# EAGLE schematic 2x_PJE_Sensoren_DS (EAGLE 9.2.2)

## Sheet 1 of 19
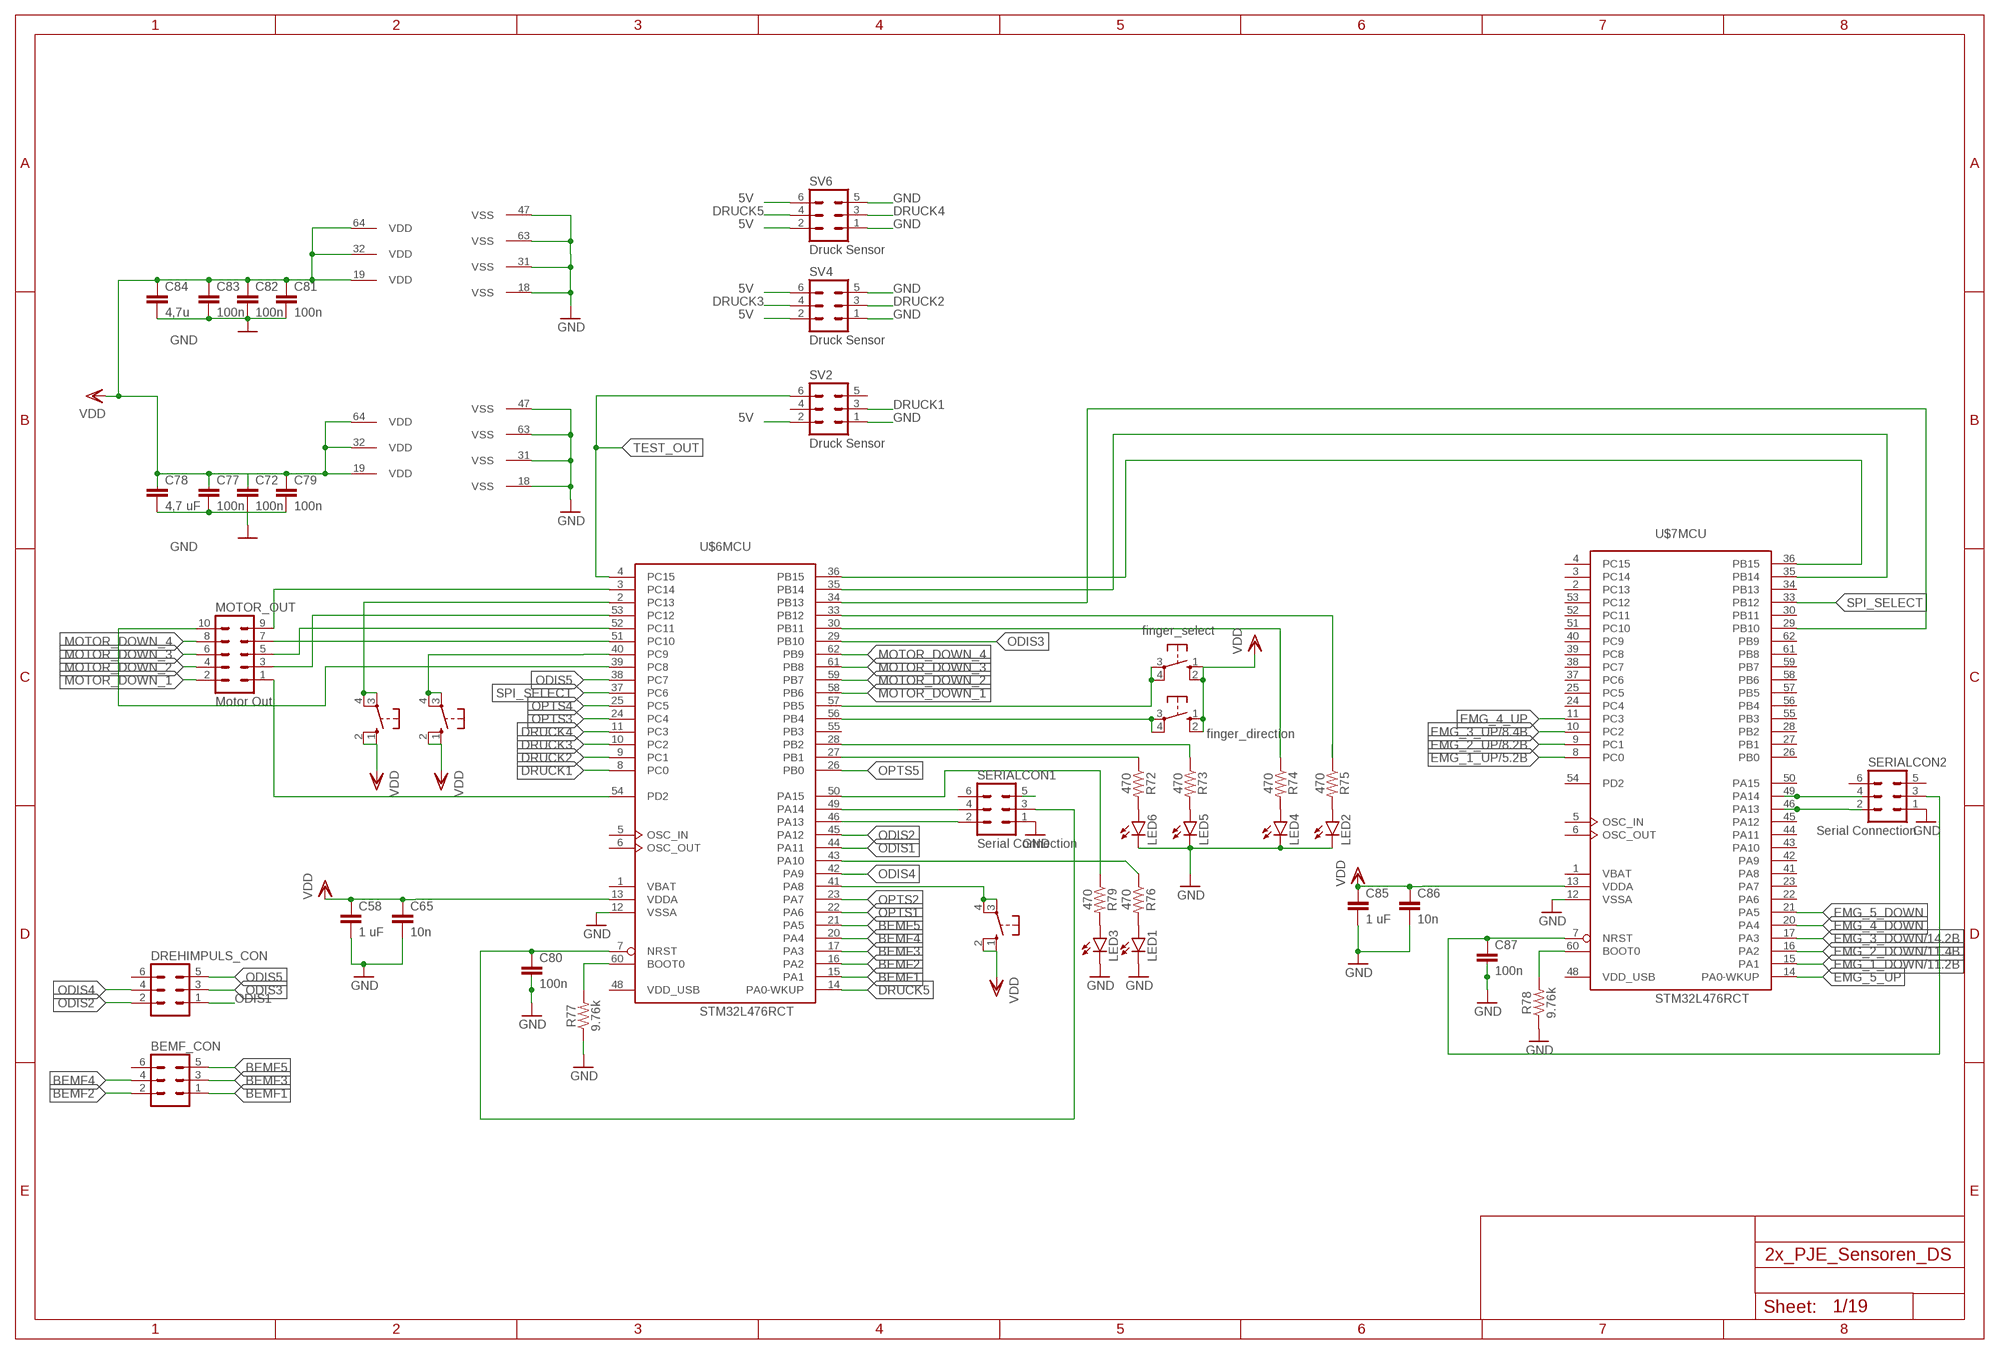
[diagram p0: schematic, sheet 1]

### Parts
BEMF_CON  ML6  [ML6]
BUTTON  10-XX  [B3F-10XX]
C58  1 uF  C-EUC0603  [C0603]
C65  10n  C-EUC0603  [C0603]
C72  100n  C-EUC0603  [C0603]
C77  100n  C-EUC0603  [C0603]
C78  4,7 uF  C-EUC0603  [C0603]
C79  100n  C-EUC0603  [C0603]
C80  100n  C-EUC0603  [C0603]
C81  100n  C-EUC0603  [C0603]
C82  100n  C-EUC0603  [C0603]
C83  100n  C-EUC0603  [C0603]
C84  4,7u  C-EUC0603  [C0603]
C85  1 uF  C-EUC0603  [C0603]
C86  10n  C-EUC0603  [C0603]
C87  100n  C-EUC0603  [C0603]
DREHIMPULS_CON  ML6  [ML6]
FINGER_DIRECTION  finger_direction  10-XX  [B3F-10XX]
FINGER_SELECT  finger_select  10-XX  [B3F-10XX]
LEARN  10-XX  [B3F-10XX]
LEARN_STOP  10-XX  [B3F-10XX]
LED1  LEDCHIP-LED0603  [CHIP-LED0603]
LED2  LEDCHIP-LED0603  [CHIP-LED0603]
LED3  LEDCHIP-LED0603  [CHIP-LED0603]
LED4  LEDCHIP-LED0603  [CHIP-LED0603]
LED5  LEDCHIP-LED0603  [CHIP-LED0603]
LED6  LEDCHIP-LED0603  [CHIP-LED0603]
MOTOR_OUT  Motor Out  ML10  [ML10]
R72  470  4.7KOHM-0603-1/10W-1%  [0603]
R73  470  4.7KOHM-0603-1/10W-1%  [0603]
R74  470  4.7KOHM-0603-1/10W-1%  [0603]
R75  470  4.7KOHM-0603-1/10W-1%  [0603]
R76  470  4.7KOHM-0603-1/10W-1%  [0603]
R77  9.76k  9.76KOHM-0603-1/10W-1%  [0603]
R78  9.76k  9.76KOHM-0603-1/10W-1%  [0603]
R79  470  4.7KOHM-0603-1/10W-1%  [0603]
SERIALCON1  Serial Connection  ML6  [ML6]
SERIALCON2  Serial Connection  ML6  [ML6]
SV2  Druck Sensor  ML6  [ML6]
SV4  Druck Sensor  ML6  [ML6]
SV6  Druck Sensor  ML6  [ML6]
U$6  STM32L476RCT  [LQFP64]
U$7  STM32L476RCT  [LQFP64]

### Nets
5V: SV2.2 SV4.2 SV4.6 SV6.2 SV6.6 ; also sheet 2
BEMF1: BEMF_CON.1 U$6.15(MCU:PA1)
BEMF2: BEMF_CON.2 U$6.16(MCU:PA2)
BEMF3: BEMF_CON.3 U$6.17(MCU:PA3)
BEMF4: BEMF_CON.4 U$6.20(MCU:PA4)
BEMF5: BEMF_CON.5 U$6.21(MCU:PA5)
DRUCK1: SV2.3 U$6.8(MCU:PC0)
DRUCK2: SV4.3 U$6.9(MCU:PC1)
DRUCK3: SV4.4 U$6.10(MCU:PC2)
DRUCK4: SV6.3 U$6.11(MCU:PC3)
DRUCK5: SV6.4 U$6.14(MCU:PA0-WKUP)
EMG_1_DOWN: U$7.15(MCU:PA1) ; also sheet 11
EMG_1_UP: U$7.8(MCU:PC0) ; also sheet 5
EMG_2_DOWN: U$7.16(MCU:PA2) ; also sheet 11
EMG_2_UP: U$7.9(MCU:PC1) ; also sheet 8
EMG_3_DOWN: U$7.17(MCU:PA3) ; also sheet 14
EMG_3_UP: U$7.10(MCU:PC2) ; also sheet 8
EMG_4_DOWN: U$7.20(MCU:PA4)
EMG_4_UP: U$7.11(MCU:PC3)
EMG_5_DOWN: U$7.21(MCU:PA5)
EMG_5_UP: U$7.14(MCU:PA0-WKUP)
GND: C58.2 C65.2 C72.2 C77.2 C78.2 C79.2 C80.2 C81.2 C82.2 C83.2 C84.2 C85.2 C86.2 C87.2 LED1.C LED2.C LED3.C LED4.C LED5.C LED6.C R77.1 R78.1 SERIALCON1.1 SERIALCON2.1 SV2.1 SV4.1 SV4.5 SV6.1 SV6.5 U$6.12(MCU:VSSA) U$6.18(PWR:VSS) U$6.31(PWR:VSS) U$6.47(PWR:VSS) U$6.63(PWR:VSS) U$7.12(MCU:VSSA) U$7.18(PWR:VSS) U$7.31(PWR:VSS) U$7.47(PWR:VSS) U$7.63(PWR:VSS) ; also sheet 2,3,4,5,6,7,8,9,10,11,12,13,14,15,16,17,18,19
LEARN: LEARN.3(P) LEARN.4(P1) U$6.41(MCU:PA8)
LEARN1: BUTTON.3(P) BUTTON.4(P1) U$6.2(MCU:PC13)
LEARN_STOP: LEARN_STOP.3(P) LEARN_STOP.4(P1) U$6.40(MCU:PC9)
LED1: R72.1 U$6.27(MCU:PB1)
LED2: R73.1 U$6.28(MCU:PB2)
LED4: R74.1 U$6.30(MCU:PB11)
LED5: R75.1 U$6.33(MCU:PB12)
MISO: U$6.35(MCU:PB14) U$7.35(MCU:PB14)
MOSI: U$6.36(MCU:PB15) U$7.36(MCU:PB15)
MOTOR_DOWN_1: MOTOR_OUT.2 U$6.58(MCU:PB6)
MOTOR_DOWN_2: MOTOR_OUT.4 U$6.59(MCU:PB7)
MOTOR_DOWN_3: MOTOR_OUT.6 U$6.61(MCU:PB8)
MOTOR_DOWN_4: MOTOR_OUT.8 U$6.62(MCU:PB9)
MOTOR_DOWN_5: MOTOR_OUT.10 U$6.39(MCU:PC8)
MOTOR_UP5: MOTOR_OUT.9 U$6.3(MCU:PC14)
MOTOR_UP_1: MOTOR_OUT.1 U$6.54(MCU:PD2)
MOTOR_UP_2: MOTOR_OUT.3 U$6.53(MCU:PC12)
MOTOR_UP_3: MOTOR_OUT.5 U$6.52(MCU:PC11)
MOTOR_UP_4: MOTOR_OUT.7 U$6.51(MCU:PC10)
N$65: LED6.A R72.2
N$66: LED5.A R73.2
N$67: LED4.A R74.2
N$68: LED2.A R75.2
N$69: LED3.A R79.2
N$70: LED1.A R76.2
N$74: R76.1 U$6.43(MCU:PA10)
N$75: FINGER_DIRECTION.3(P) FINGER_DIRECTION.4(P1) U$6.56(MCU:PB4)
N$76: FINGER_SELECT.3(P) FINGER_SELECT.4(P1) U$6.57(MCU:PB5)
N$90: SERIALCON1.4 U$6.49(MCU:PA14)
N$91: SERIALCON1.2 U$6.46(MCU:PA13)
N$92: R77.2 U$6.60(MCU:BOOT0)
N$93: R78.2 U$7.60(MCU:BOOT0)
N$97: R79.1 U$6.50(MCU:PA15)
N$98: SERIALCON1.5
NRST1: C80.1 SERIALCON1.3 U$6.7(MCU:NRST)
NRST2: C87.1 SERIALCON2.3 U$7.7(MCU:NRST)
ODIS1: DREHIMPULS_CON.1 U$6.44(MCU:PA11)
ODIS2: DREHIMPULS_CON.2 U$6.45(MCU:PA12)
ODIS3: DREHIMPULS_CON.3 U$6.29(MCU:PB10)
ODIS4: DREHIMPULS_CON.4 U$6.42(MCU:PA9)
ODIS5: DREHIMPULS_CON.5 U$6.38(MCU:PC7)
OPTS1: U$6.22(MCU:PA6) ; also sheet 15
OPTS2: U$6.23(MCU:PA7) ; also sheet 16
OPTS3: U$6.24(MCU:PC4) ; also sheet 17
OPTS4: U$6.25(MCU:PC5) ; also sheet 18
OPTS5: U$6.26(MCU:PB0) ; also sheet 19
SPI_CLK: U$6.34(MCU:PB13) U$7.29(MCU:PB10)
SPI_SELECT: U$6.37(MCU:PC6) U$7.33(MCU:PB12)
TCK2: SERIALCON2.4 U$7.49(MCU:PA14)
TEST_OUT: SV2.6 U$6.4(MCU:PC15)
TMS2: SERIALCON2.2 U$7.46(MCU:PA13)
VDD: BUTTON.1(S) BUTTON.2(S1) C58.1 C65.1 C72.1 C77.1 C78.1 C79.1 C81.1 C82.1 C83.1 C84.1 C85.1 C86.1 FINGER_DIRECTION.1(S) FINGER_DIRECTION.2(S1) FINGER_SELECT.1(S) FINGER_SELECT.2(S1) LEARN.1(S) LEARN.2(S1) LEARN_STOP.1(S) LEARN_STOP.2(S1) U$6.13(MCU:VDDA) U$6.19(PWR:VDD) U$6.32(PWR:VDD) U$6.64(PWR:VDD) U$7.13(MCU:VDDA) U$7.19(PWR:VDD) U$7.32(PWR:VDD) U$7.64(PWR:VDD) ; also sheet 2,3,4,5,6,7,8,9,10,11,12,13,14,15,16,17,18,19
Unconnected: BEMF_CON.6 DREHIMPULS_CON.6 SERIALCON1.6 SERIALCON2.5 SERIALCON2.6 SV2.4 SV2.5 U$6.5(MCU:OSC_IN) U$6.6(MCU:OSC_OUT) U$6.55(MCU:PB3) U$7.2(MCU:PC13) U$7.3(MCU:PC14) U$7.4(MCU:PC15) U$7.5(MCU:OSC_IN) U$7.6(MCU:OSC_OUT) U$7.22(MCU:PA6) U$7.23(MCU:PA7) U$7.24(MCU:PC4) U$7.25(MCU:PC5) U$7.26(MCU:PB0) U$7.27(MCU:PB1) U$7.28(MCU:PB2) U$7.30(MCU:PB11) U$7.34(MCU:PB13) U$7.37(MCU:PC6) U$7.38(MCU:PC7) U$7.39(MCU:PC8) U$7.40(MCU:PC9) U$7.41(MCU:PA8) U$7.42(MCU:PA9) U$7.43(MCU:PA10) U$7.44(MCU:PA11) U$7.45(MCU:PA12) U$7.50(MCU:PA15) U$7.51(MCU:PC10) U$7.52(MCU:PC11) U$7.53(MCU:PC12) U$7.54(MCU:PD2) U$7.55(MCU:PB3) U$7.56(MCU:PB4) U$7.57(MCU:PB5) U$7.58(MCU:PB6) U$7.59(MCU:PB7) U$7.61(MCU:PB8) U$7.62(MCU:PB9)

## Sheet 2 of 19
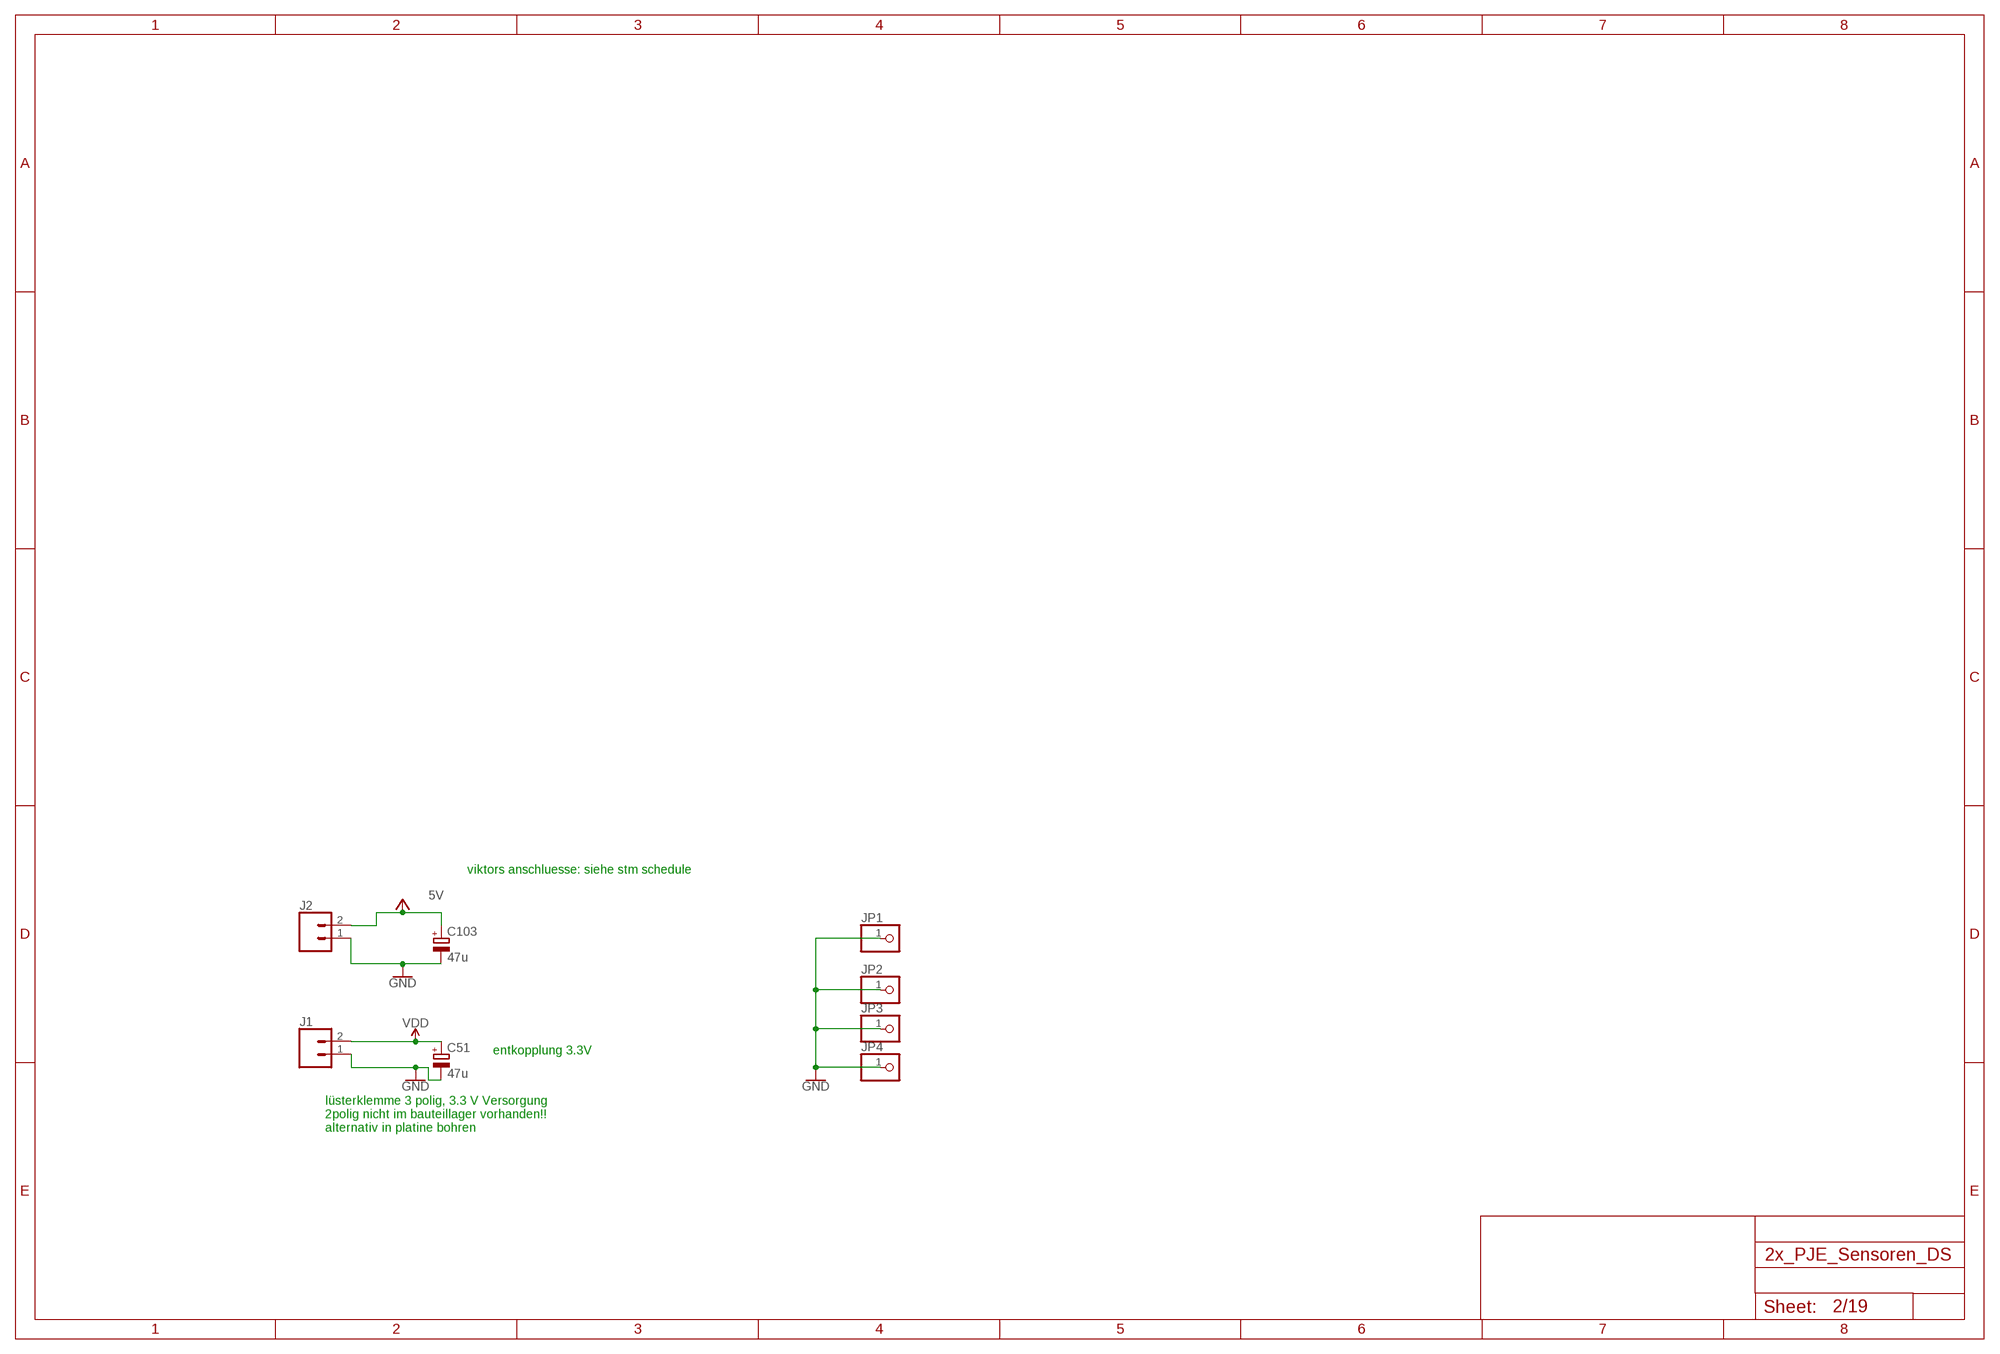
[diagram p1: schematic, sheet 2]

### Parts
C51  47u  CPOL-EUTAP5-70  [TAP5-70]
C103  47u  CPOL-EUTAP5-70  [TAP5-70]
J1  CONN_02POLAR  [MOLEX-1X2]
J2  CONN_02POLAR  [MOLEX-1X2]
JP1  PINHD-1X1  [1X01]
JP2  PINHD-1X1  [1X01]
JP3  PINHD-1X1  [1X01]
JP4  PINHD-1X1  [1X01]

### Nets
5V: C103.+ J2.2 ; supply symbol labelled +5V ; also sheet 1
GND: C51.- C103.- J1.1 J2.1 JP1.1 JP2.1 JP3.1 JP4.1 ; also sheet 1,3,4,5,6,7,8,9,10,11,12,13,14,15,16,17,18,19
VDD: C51.+ J1.2 ; also sheet 1,3,4,5,6,7,8,9,10,11,12,13,14,15,16,17,18,19

### Notes on the sheet
- viktors anschluesse: siehe stm schedule
- entkopplung 3.3V
- lüsterklemme 3 polig, 3.3 V Versorgung
  2polig nicht im bauteillager vorhanden!!
  alternativ in platine bohren

## Sheet 3 of 19
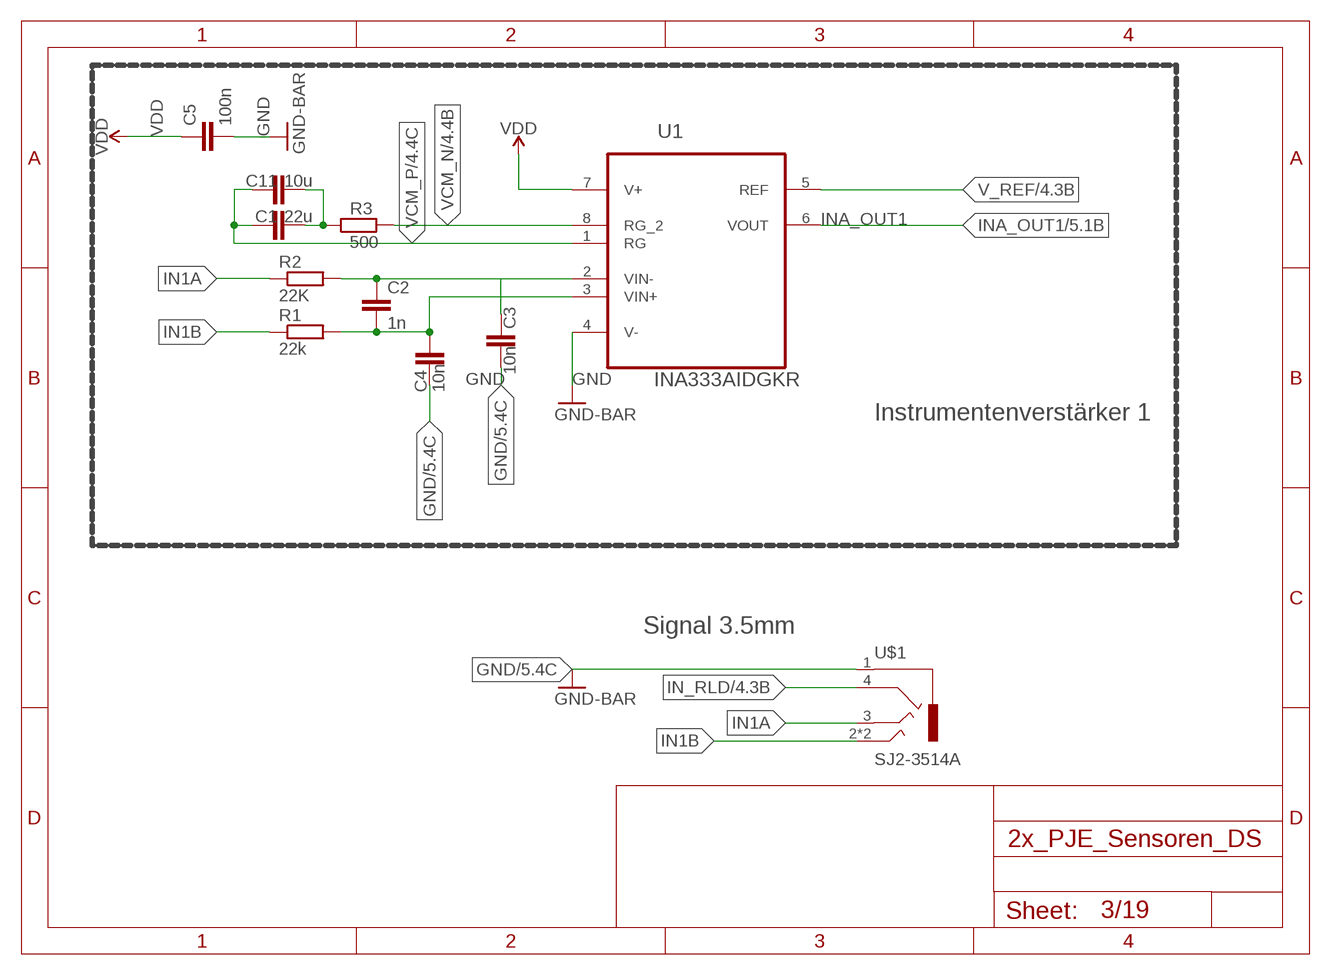
[diagram p2: schematic, sheet 3]

### Parts
C1  22u  C-EUC0603  [C0603]
C2  1n  C-EUC0603  [C0603]
C3  10n  C-EUC0603  [C0603]
C4  10n  C-EUC0603  [C0603]
C5  100n  C-EUC0603  [C0603]
C11  10u  C-EUC0603  [C0603]
R1  22k  R-EU_R0603  [R0603]
R2  22K  R-EU_R0603  [R0603]
R3  500  R-EU_R0603  [R0603]
U1  INA333AIDGKR  [SOP65P490X110-8N]
U$1  SJ2-3514A  [USR_SJ2-4514A]

### Nets
GND: C3.2 C4.2 C5.2 U1.4(V-) U$1.1 ; supply symbol labelled GND-BAR ; also sheet 1,2,4,5,6,7,8,9,10,11,12,13,14,15,16,17,18,19
IN1A: R2.1 U$1.3
IN1B: R1.1 U$1.2 U$1.2_2
IN_RLD: U$1.4 ; also sheet 4
INA_OUT1: U1.6(VOUT) ; also sheet 5
N$3: C2.2 C4.1 R1.2 U1.3(VIN+)
N$4: C1.2 C11.2 R3.1
N$35: C2.1 C3.1 R2.2 U1.2(VIN-)
V_REF: U1.5(REF) ; also sheet 4,5,6,7,8,9,10,11,12,13,14
VCM_N: R3.2 U1.8(RG_2) ; also sheet 4
VCM_P: C1.1 C11.1 U1.1(RG) ; also sheet 4
VDD: C5.1 U1.7(V+) ; also sheet 1,2,4,5,6,7,8,9,10,11,12,13,14,15,16,17,18,19

### Notes on the sheet
- Instrumentenverstärker 1
- Signal 3.5mm

## Sheet 4 of 19
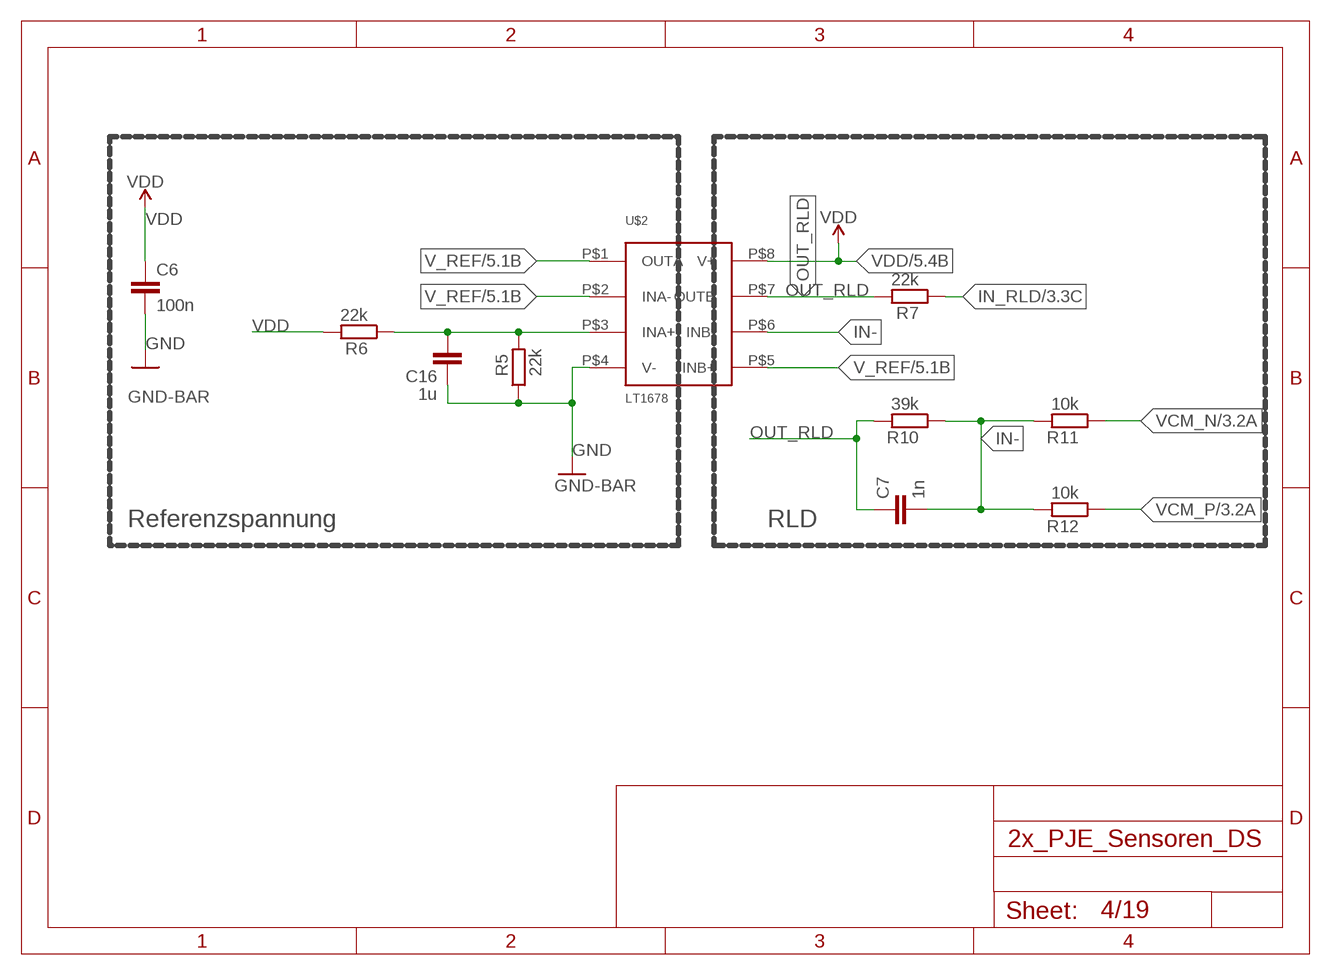
[diagram p3: schematic, sheet 4]

### Parts
C6  100n  C-EUC0603  [C0603]
C7  1n  C-EUC0603  [C0603]
C16  1u  C-EUC0603  [C0603]
R5  22k  R-EU_R0603  [R0603]
R6  22k  R-EU_R0603  [R0603]
R7  22k  R-EU_R0603  [R0603]
R10  39k  R-EU_R0603  [R0603]
R11  10k  R-EU_R0603  [R0603]
R12  10k  R-EU_R0603  [R0603]
U$2  LT1678  [S8]

### Nets
GND: C6.2 C16.1 R5.1 U$2.P$4(V-) ; supply symbol labelled GND-BAR ; also sheet 1,2,3,5,6,7,8,9,10,11,12,13,14,15,16,17,18,19
IN-: C7.2 R10.1 R11.2 R12.2 U$2.P$6(INB-)
IN_RLD: R7.1 ; also sheet 3
N$11: C16.2 R5.2 R6.1 U$2.P$3(INA+)
OUT_RLD: C7.1 R7.2 R10.2 U$2.P$7(OUTB)
V_REF: U$2.P$1(OUTA) U$2.P$2(INA-) U$2.P$5(INB+) ; also sheet 3,5,6,7,8,9,10,11,12,13,14
VCM_N: R11.1 ; also sheet 3
VCM_P: R12.1 ; also sheet 3
VDD: C6.1 R6.2 U$2.P$8(V+) ; also sheet 1,2,3,5,6,7,8,9,10,11,12,13,14,15,16,17,18,19

### Notes on the sheet
- Referenzspannung | RLD

## Sheet 5 of 19
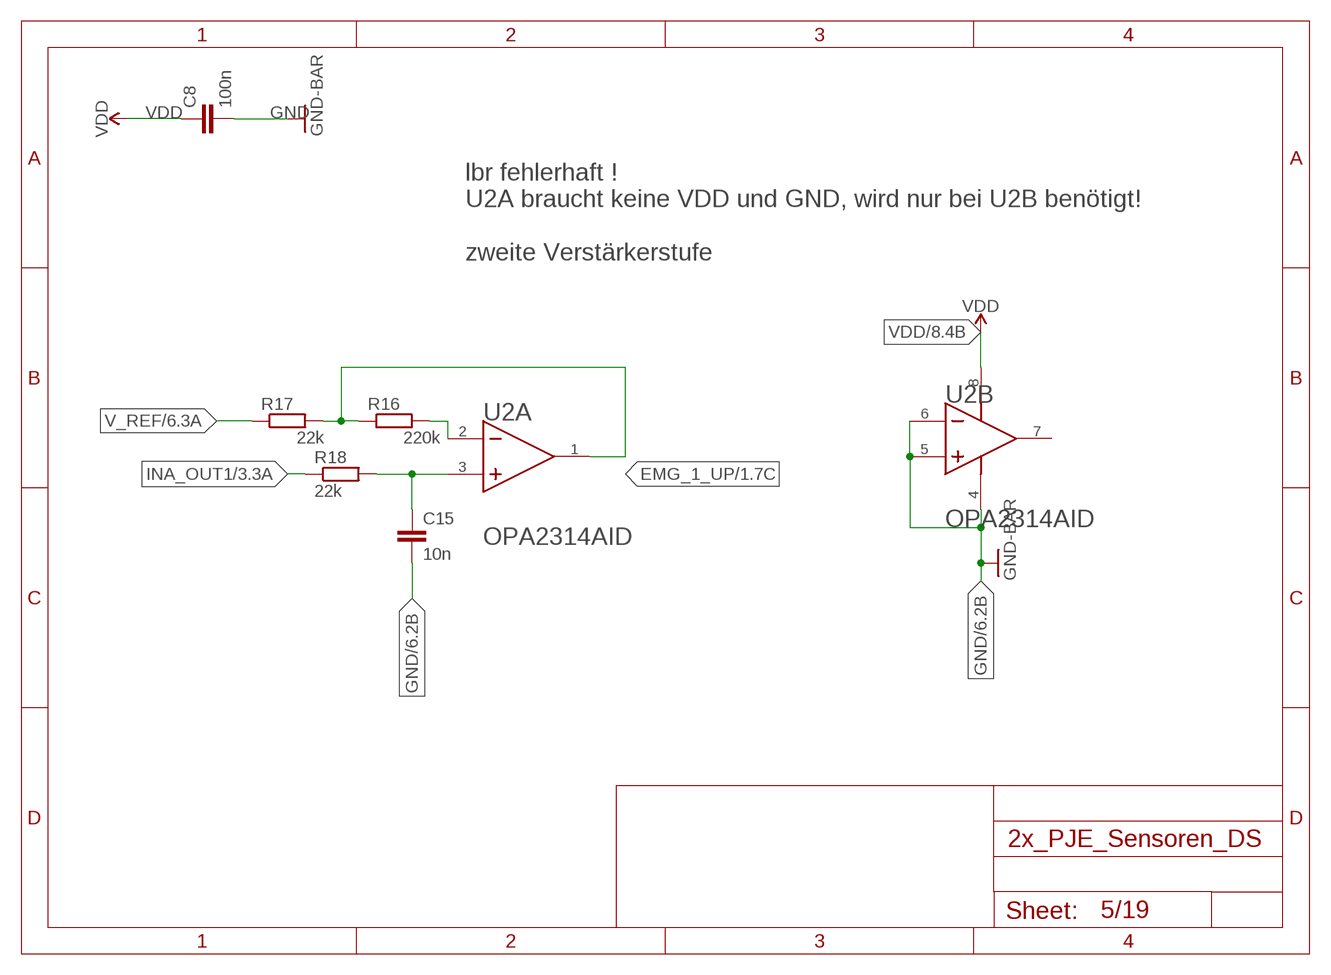
[diagram p4: schematic, sheet 5]

### Parts
C8  100n  C-EUC0603  [C0603]
C15  10n  C-EUC0603  [C0603]
R16  220k  R-EU_R0603  [R0603]
R17  22k  R-EU_R0603  [R0603]
R18  22k  R-EU_R0603  [R0603]
U2  TEXAS_INSTRUMENTS_OPA2314AIDTEXAS_INSTRUMENTS_OPA2314AID_0_0  [TEXAS_INSTRUMENTS_OPA2314AID_0]

### Nets
EMG_1_UP: R16.1 R17.2 U2.1(A:OUT_A) ; also sheet 1
GND: C8.2 C15.2 U2.4(B:V-) U2.5(B:IN_B+) U2.6(B:IN_B-) ; supply symbol labelled GND-BAR ; also sheet 1,2,3,4,6,7,8,9,10,11,12,13,14,15,16,17,18,19
INA_OUT1: R18.1 ; also sheet 3
N$16: R16.2 U2.2(A:IN_A-)
N$17: C15.1 R18.2 U2.3(A:IN_A+)
V_REF: R17.1 ; also sheet 3,4,6,7,8,9,10,11,12,13,14
VDD: C8.1 U2.8(B:V+) ; also sheet 1,2,3,4,6,7,8,9,10,11,12,13,14,15,16,17,18,19
Unconnected: U2.7(B:OUT_B)

### Notes on the sheet
- lbr fehlerhaft !
  U2A braucht keine VDD und GND, wird nur bei U2B benötigt!
  
  zweite Verstärkerstufe

## Sheet 6 of 19
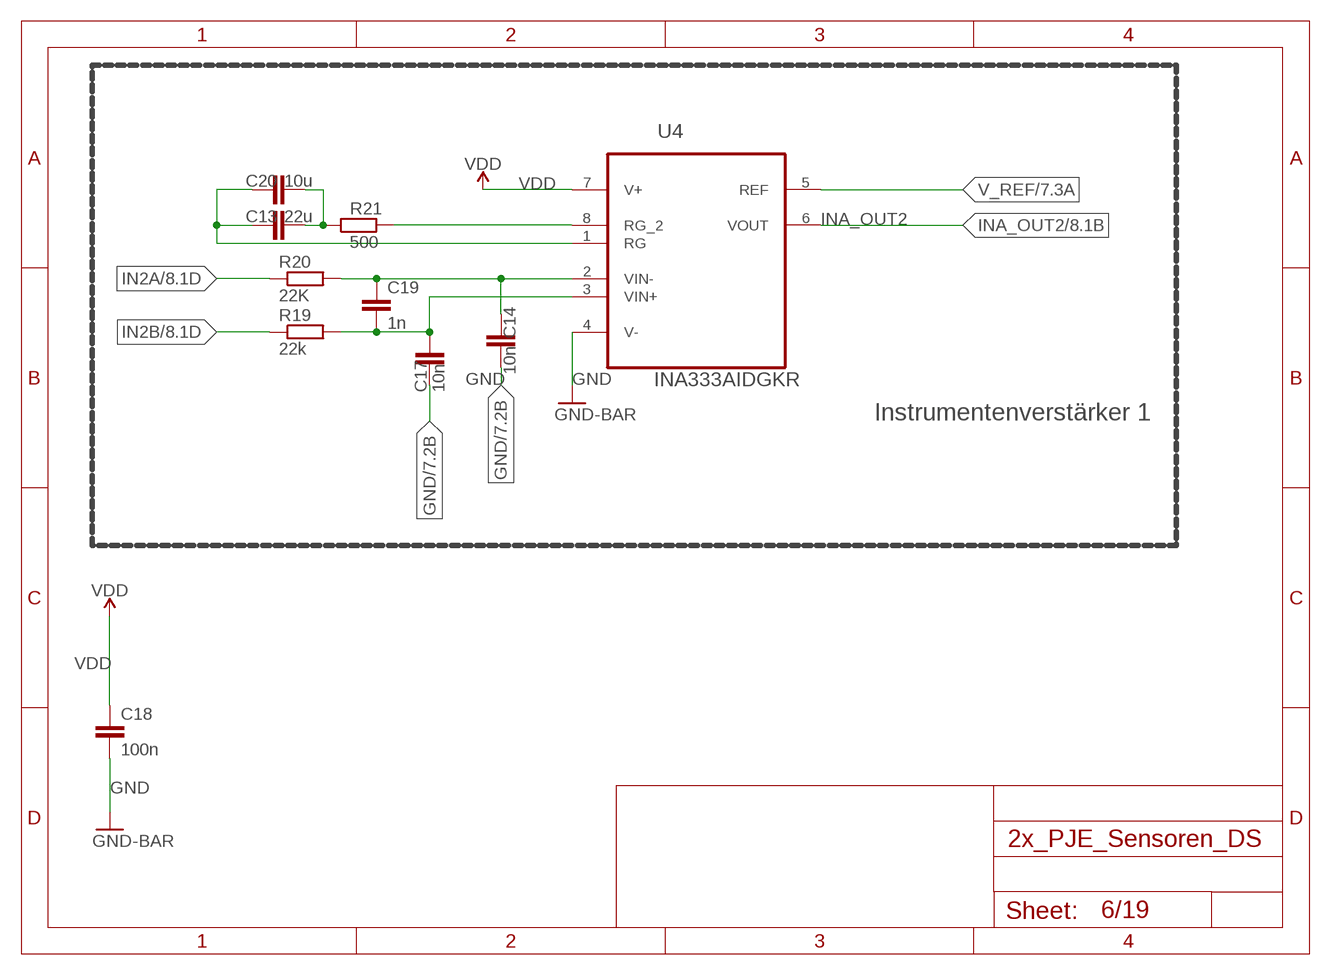
[diagram p5: schematic, sheet 6]

### Parts
C13  22u  C-EUC0603  [C0603]
C14  10n  C-EUC0603  [C0603]
C17  10n  C-EUC0603  [C0603]
C18  100n  C-EUC0603  [C0603]
C19  1n  C-EUC0603  [C0603]
C20  10u  C-EUC0603  [C0603]
R19  22k  R-EU_R0603  [R0603]
R20  22K  R-EU_R0603  [R0603]
R21  500  R-EU_R0603  [R0603]
U4  INA333AIDGKR  [SOP65P490X110-8N]

### Nets
GND: C14.2 C17.2 C18.2 U4.4(V-) ; supply symbol labelled GND-BAR ; also sheet 1,2,3,4,5,7,8,9,10,11,12,13,14,15,16,17,18,19
IN2A: R20.1 ; also sheet 8
IN2B: R19.1 ; also sheet 8
INA_OUT2: U4.6(VOUT) ; also sheet 8
N$1: C13.2 C20.2 R21.1
N$5: R21.2 U4.8(RG_2)
N$6: C13.1 C20.1 U4.1(RG)
N$7: C14.1 C19.1 R20.2 U4.2(VIN-)
N$12: C17.1 C19.2 R19.2 U4.3(VIN+)
V_REF: U4.5(REF) ; also sheet 3,4,5,7,8,9,10,11,12,13,14
VDD: C18.1 U4.7(V+) ; also sheet 1,2,3,4,5,7,8,9,10,11,12,13,14,15,16,17,18,19

### Notes on the sheet
- Instrumentenverstärker 1

## Sheet 7 of 19
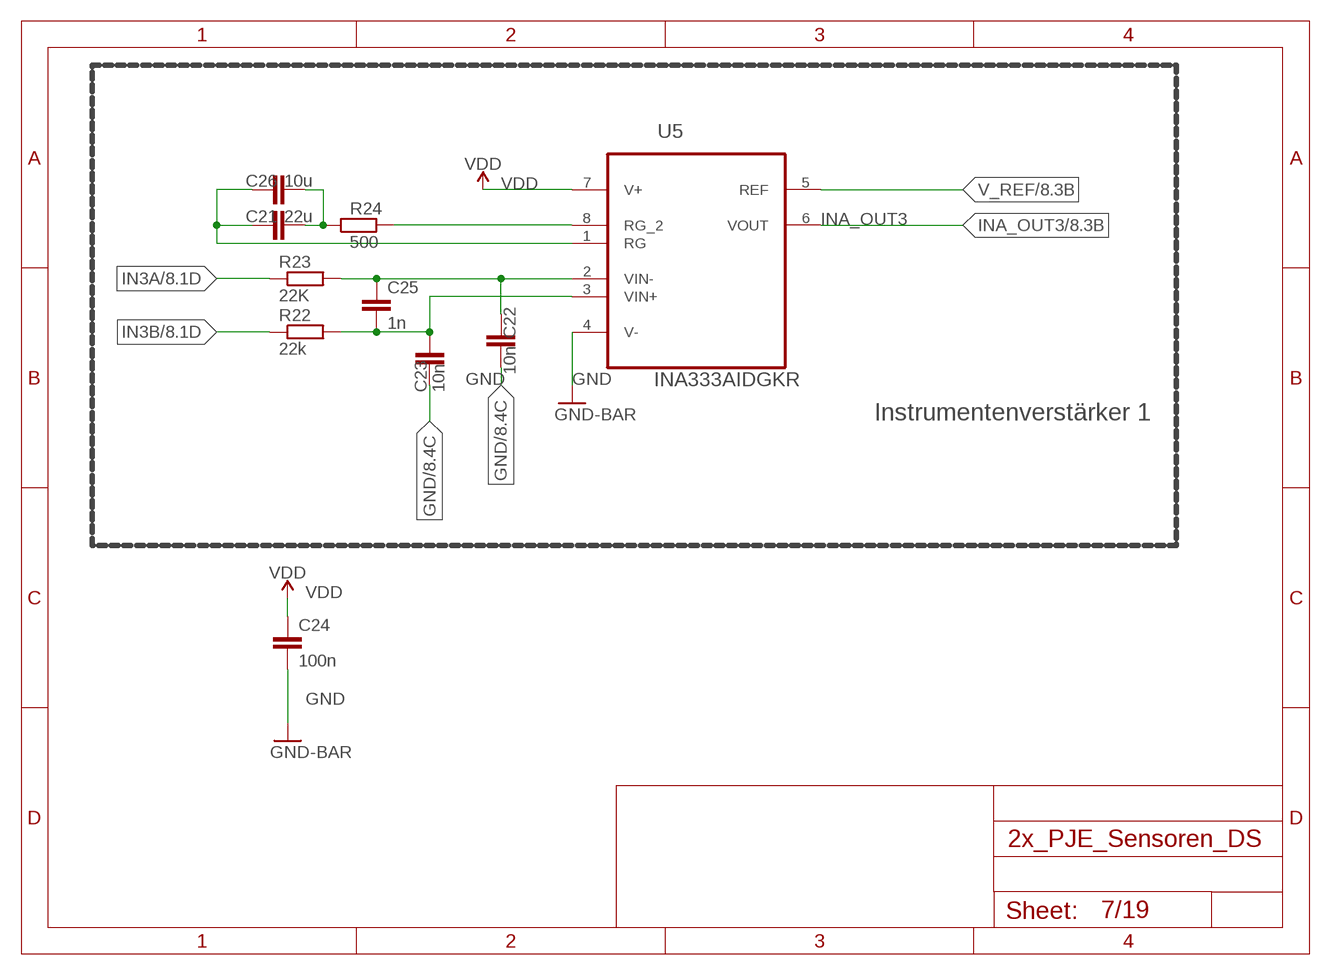
[diagram p6: schematic, sheet 7]

### Parts
C21  22u  C-EUC0603  [C0603]
C22  10n  C-EUC0603  [C0603]
C23  10n  C-EUC0603  [C0603]
C24  100n  C-EUC0603  [C0603]
C25  1n  C-EUC0603  [C0603]
C26  10u  C-EUC0603  [C0603]
R22  22k  R-EU_R0603  [R0603]
R23  22K  R-EU_R0603  [R0603]
R24  500  R-EU_R0603  [R0603]
U5  INA333AIDGKR  [SOP65P490X110-8N]

### Nets
GND: C22.2 C23.2 C24.2 U5.4(V-) ; supply symbol labelled GND-BAR ; also sheet 1,2,3,4,5,6,8,9,10,11,12,13,14,15,16,17,18,19
IN3A: R23.1 ; also sheet 8
IN3B: R22.1 ; also sheet 8
INA_OUT3: U5.6(VOUT) ; also sheet 8
N$8: C21.2 C26.2 R24.1
N$9: R24.2 U5.8(RG_2)
N$10: C21.1 C26.1 U5.1(RG)
N$13: C22.1 C25.1 R23.2 U5.2(VIN-)
N$14: C23.1 C25.2 R22.2 U5.3(VIN+)
V_REF: U5.5(REF) ; also sheet 3,4,5,6,8,9,10,11,12,13,14
VDD: C24.1 U5.7(V+) ; also sheet 1,2,3,4,5,6,8,9,10,11,12,13,14,15,16,17,18,19

### Notes on the sheet
- Instrumentenverstärker 1

## Sheet 8 of 19
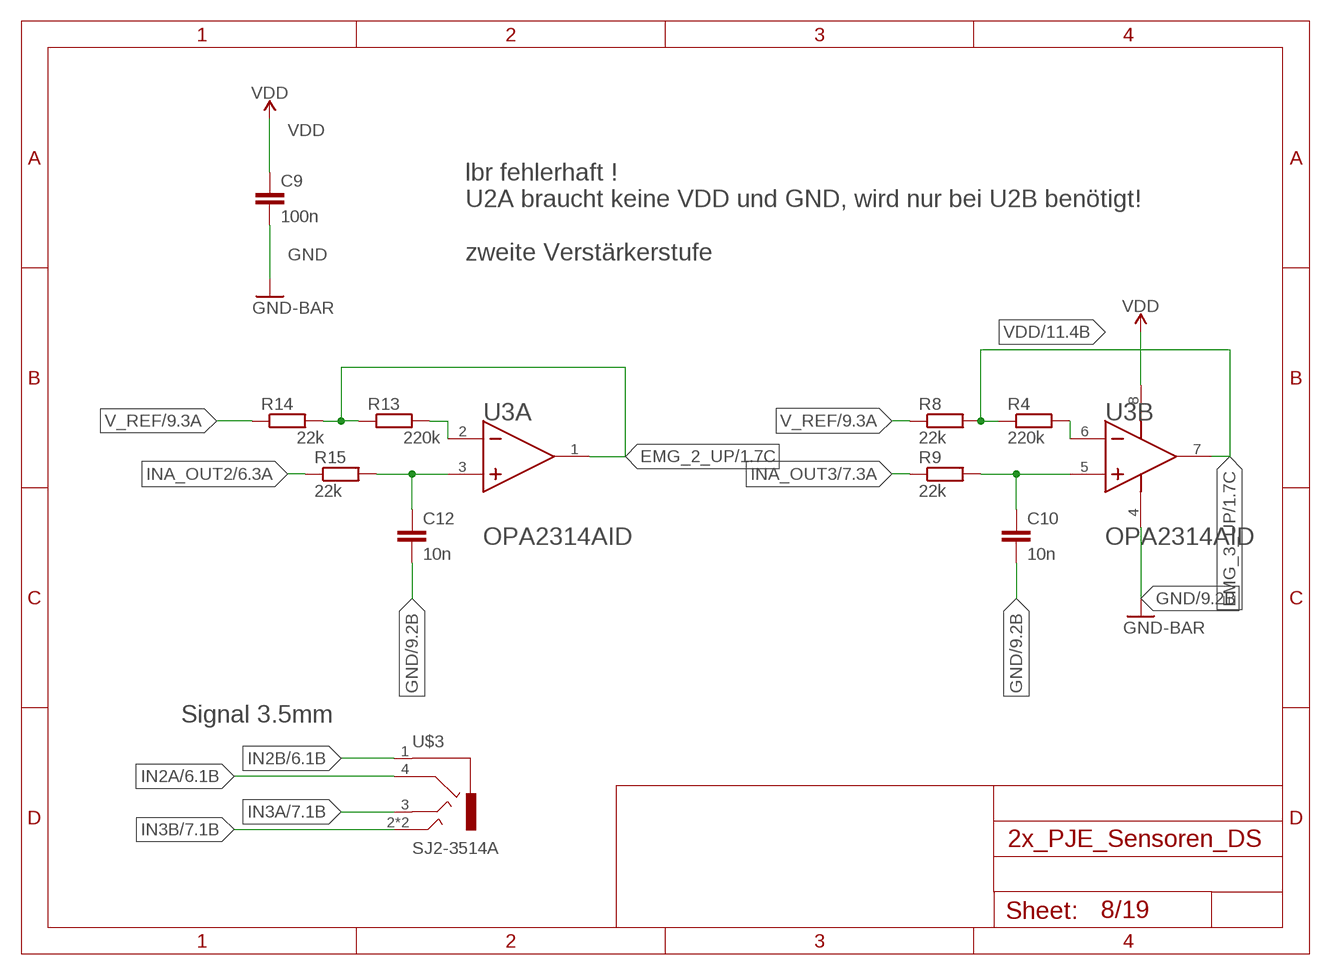
[diagram p7: schematic, sheet 8]

### Parts
C9  100n  C-EUC0603  [C0603]
C10  10n  C-EUC0603  [C0603]
C12  10n  C-EUC0603  [C0603]
R4  220k  R-EU_R0603  [R0603]
R8  22k  R-EU_R0603  [R0603]
R9  22k  R-EU_R0603  [R0603]
R13  220k  R-EU_R0603  [R0603]
R14  22k  R-EU_R0603  [R0603]
R15  22k  R-EU_R0603  [R0603]
U3  TEXAS_INSTRUMENTS_OPA2314AIDTEXAS_INSTRUMENTS_OPA2314AID_0_0  [TEXAS_INSTRUMENTS_OPA2314AID_0]
U$3  SJ2-3514A  [USR_SJ2-4514A]

### Nets
EMG_2_UP: R13.1 R14.2 U3.1(A:OUT_A) ; also sheet 1
EMG_3_UP: R4.1 R8.2 U3.7(B:OUT_B) ; also sheet 1
GND: C9.2 C10.2 C12.2 U3.4(B:V-) ; supply symbol labelled GND-BAR ; also sheet 1,2,3,4,5,6,7,9,10,11,12,13,14,15,16,17,18,19
IN2A: U$3.4 ; also sheet 6
IN2B: U$3.1 ; also sheet 6
IN3A: U$3.3 ; also sheet 7
IN3B: U$3.2 U$3.2_2 ; also sheet 7
INA_OUT2: R15.1 ; also sheet 6
INA_OUT3: R9.1 ; also sheet 7
N$15: C10.1 R9.2 U3.5(B:IN_B+)
N$18: R4.2 U3.6(B:IN_B-)
N$19: C12.1 R15.2 U3.3(A:IN_A+)
N$20: R13.2 U3.2(A:IN_A-)
V_REF: R8.1 R14.1 ; also sheet 3,4,5,6,7,9,10,11,12,13,14
VDD: C9.1 U3.8(B:V+) ; also sheet 1,2,3,4,5,6,7,9,10,11,12,13,14,15,16,17,18,19

### Notes on the sheet
- lbr fehlerhaft !
  U2A braucht keine VDD und GND, wird nur bei U2B benötigt!
  
  zweite Verstärkerstufe
- Signal 3.5mm

## Sheet 9 of 19
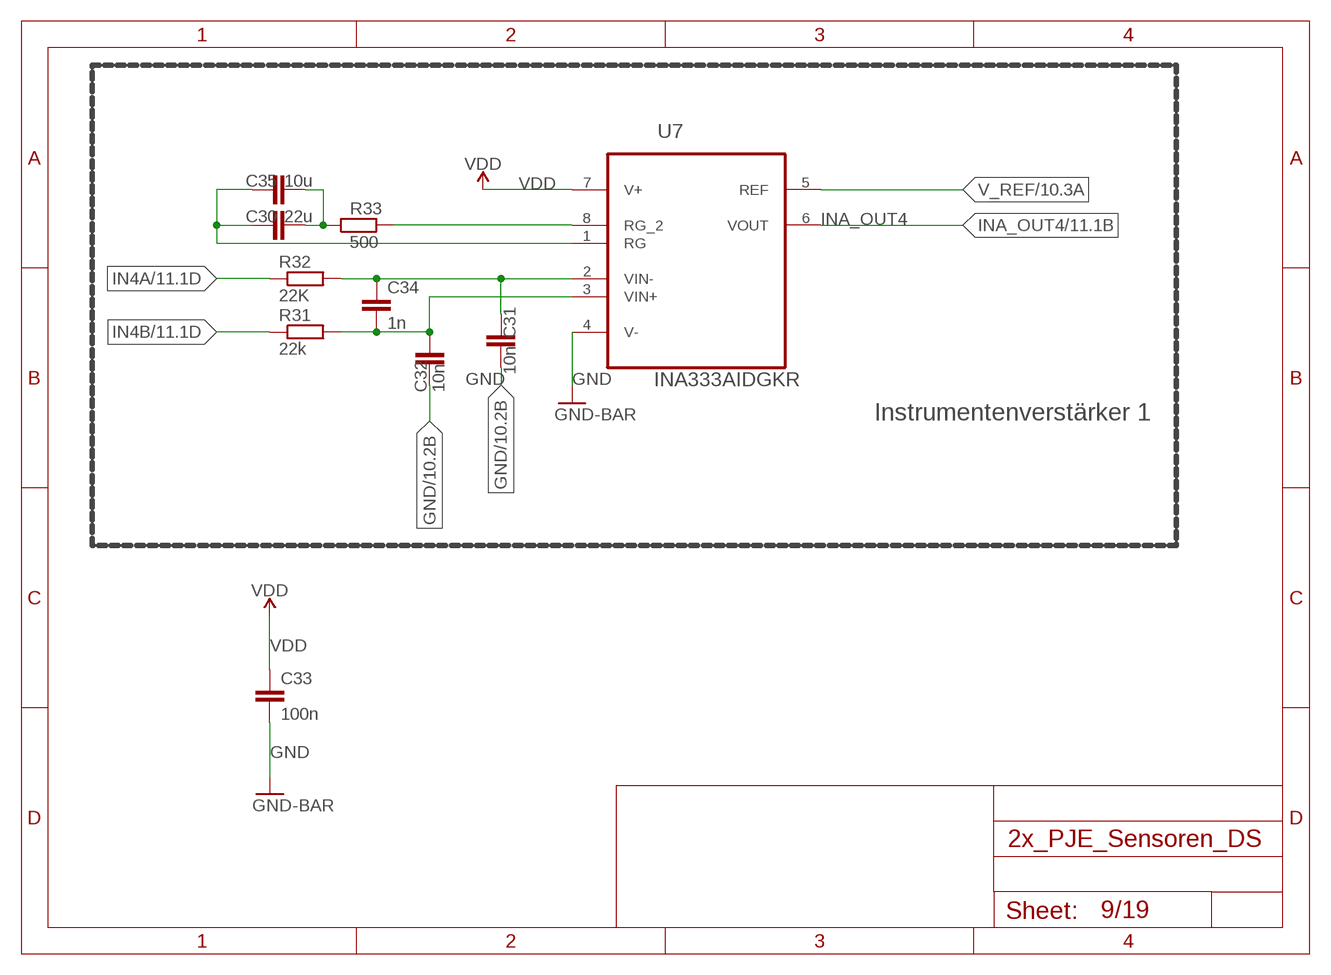
[diagram p8: schematic, sheet 9]

### Parts
C30  22u  C-EUC0603  [C0603]
C31  10n  C-EUC0603  [C0603]
C32  10n  C-EUC0603  [C0603]
C33  100n  C-EUC0603  [C0603]
C34  1n  C-EUC0603  [C0603]
C35  10u  C-EUC0603  [C0603]
R31  22k  R-EU_R0603  [R0603]
R32  22K  R-EU_R0603  [R0603]
R33  500  R-EU_R0603  [R0603]
U7  INA333AIDGKR  [SOP65P490X110-8N]

### Nets
GND: C31.2 C32.2 C33.2 U7.4(V-) ; supply symbol labelled GND-BAR ; also sheet 1,2,3,4,5,6,7,8,10,11,12,13,14,15,16,17,18,19
IN4A: R32.1 ; also sheet 11
IN4B: R31.1 ; also sheet 11
INA_OUT4: U7.6(VOUT) ; also sheet 11
N$21: C30.2 C35.2 R33.1
N$22: R33.2 U7.8(RG_2)
N$23: C30.1 C35.1 U7.1(RG)
N$24: C31.1 C34.1 R32.2 U7.2(VIN-)
N$25: C32.1 C34.2 R31.2 U7.3(VIN+)
V_REF: U7.5(REF) ; also sheet 3,4,5,6,7,8,10,11,12,13,14
VDD: C33.1 U7.7(V+) ; also sheet 1,2,3,4,5,6,7,8,10,11,12,13,14,15,16,17,18,19

### Notes on the sheet
- Instrumentenverstärker 1

## Sheet 10 of 19
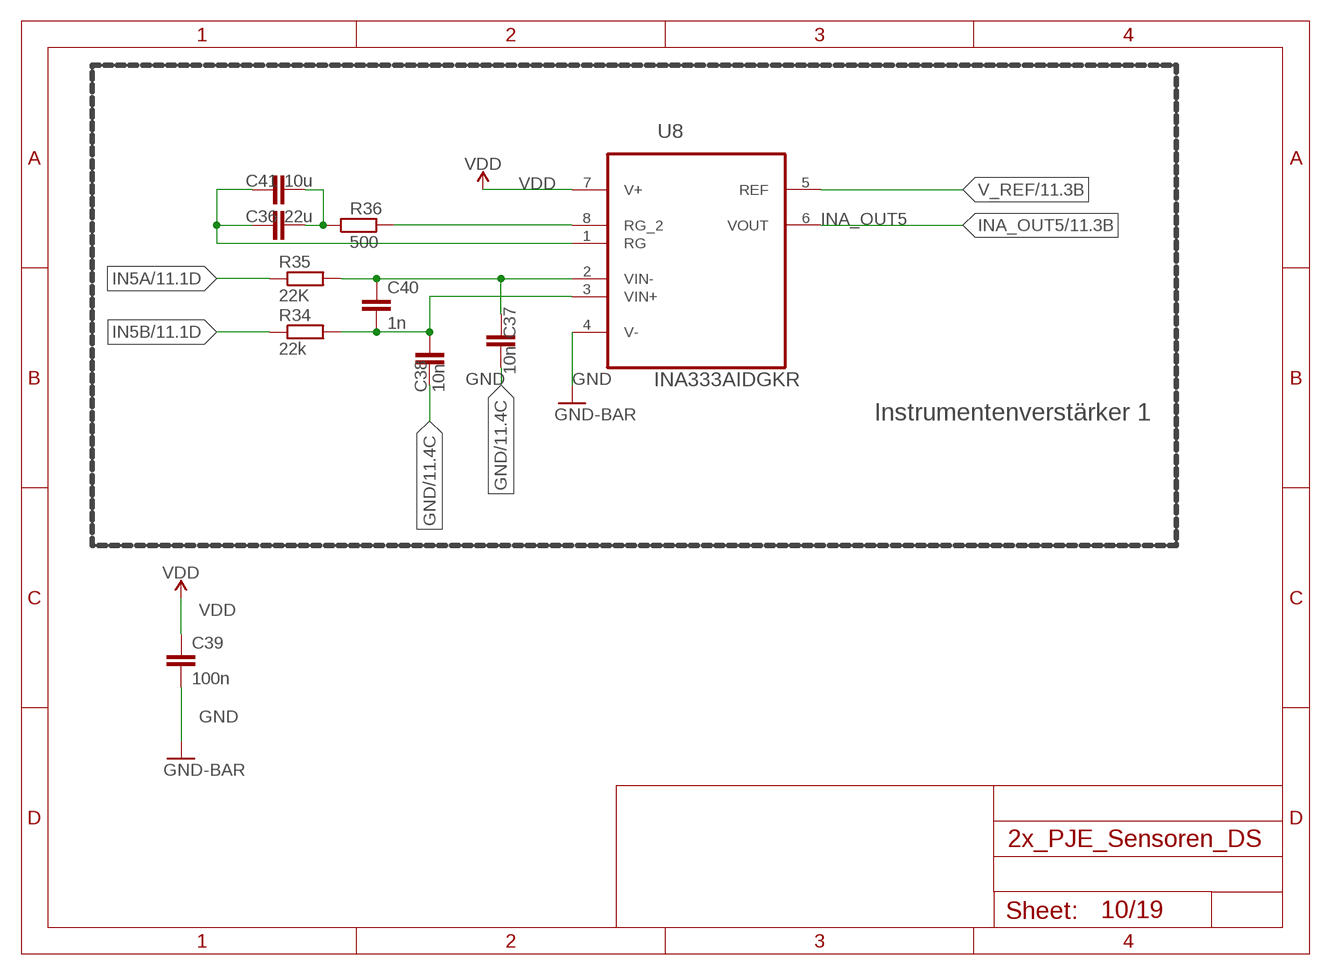
[diagram p9: schematic, sheet 10]

### Parts
C36  22u  C-EUC0603  [C0603]
C37  10n  C-EUC0603  [C0603]
C38  10n  C-EUC0603  [C0603]
C39  100n  C-EUC0603  [C0603]
C40  1n  C-EUC0603  [C0603]
C41  10u  C-EUC0603  [C0603]
R34  22k  R-EU_R0603  [R0603]
R35  22K  R-EU_R0603  [R0603]
R36  500  R-EU_R0603  [R0603]
U8  INA333AIDGKR  [SOP65P490X110-8N]

### Nets
GND: C37.2 C38.2 C39.2 U8.4(V-) ; supply symbol labelled GND-BAR ; also sheet 1,2,3,4,5,6,7,8,9,11,12,13,14,15,16,17,18,19
IN5A: R35.1 ; also sheet 11
IN5B: R34.1 ; also sheet 11
INA_OUT5: U8.6(VOUT) ; also sheet 11
N$26: C36.2 C41.2 R36.1
N$27: R36.2 U8.8(RG_2)
N$28: C36.1 C41.1 U8.1(RG)
N$29: C37.1 C40.1 R35.2 U8.2(VIN-)
N$30: C38.1 C40.2 R34.2 U8.3(VIN+)
V_REF: U8.5(REF) ; also sheet 3,4,5,6,7,8,9,11,12,13,14
VDD: C39.1 U8.7(V+) ; also sheet 1,2,3,4,5,6,7,8,9,11,12,13,14,15,16,17,18,19

### Notes on the sheet
- Instrumentenverstärker 1

## Sheet 11 of 19
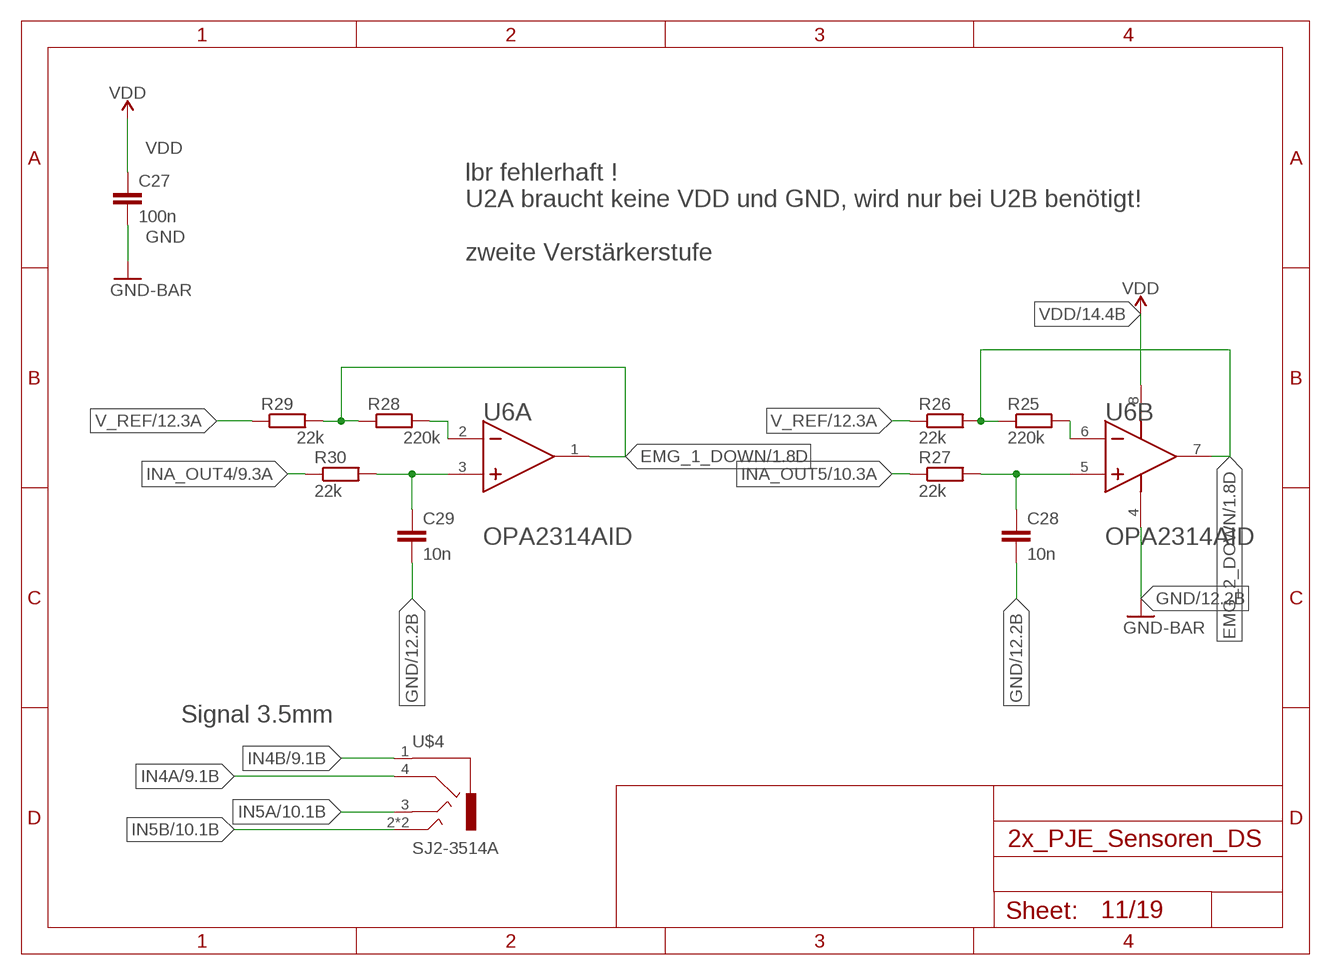
[diagram p10: schematic, sheet 11]

### Parts
C27  100n  C-EUC0603  [C0603]
C28  10n  C-EUC0603  [C0603]
C29  10n  C-EUC0603  [C0603]
R25  220k  R-EU_R0603  [R0603]
R26  22k  R-EU_R0603  [R0603]
R27  22k  R-EU_R0603  [R0603]
R28  220k  R-EU_R0603  [R0603]
R29  22k  R-EU_R0603  [R0603]
R30  22k  R-EU_R0603  [R0603]
U6  TEXAS_INSTRUMENTS_OPA2314AIDTEXAS_INSTRUMENTS_OPA2314AID_0_0  [TEXAS_INSTRUMENTS_OPA2314AID_0]
U$4  SJ2-3514A  [USR_SJ2-4514A]

### Nets
EMG_1_DOWN: R28.1 R29.2 U6.1(A:OUT_A) ; also sheet 1
EMG_2_DOWN: R25.1 R26.2 U6.7(B:OUT_B) ; also sheet 1
GND: C27.2 C28.2 C29.2 U6.4(B:V-) ; supply symbol labelled GND-BAR ; also sheet 1,2,3,4,5,6,7,8,9,10,12,13,14,15,16,17,18,19
IN4A: U$4.4 ; also sheet 9
IN4B: U$4.1 ; also sheet 9
IN5A: U$4.3 ; also sheet 10
IN5B: U$4.2 U$4.2_2 ; also sheet 10
INA_OUT4: R30.1 ; also sheet 9
INA_OUT5: R27.1 ; also sheet 10
N$31: C28.1 R27.2 U6.5(B:IN_B+)
N$32: R25.2 U6.6(B:IN_B-)
N$33: C29.1 R30.2 U6.3(A:IN_A+)
N$34: R28.2 U6.2(A:IN_A-)
V_REF: R26.1 R29.1 ; also sheet 3,4,5,6,7,8,9,10,12,13,14
VDD: C27.1 U6.8(B:V+) ; also sheet 1,2,3,4,5,6,7,8,9,10,12,13,14,15,16,17,18,19

### Notes on the sheet
- lbr fehlerhaft !
  U2A braucht keine VDD und GND, wird nur bei U2B benötigt!
  
  zweite Verstärkerstufe
- Signal 3.5mm

## Sheet 12 of 19
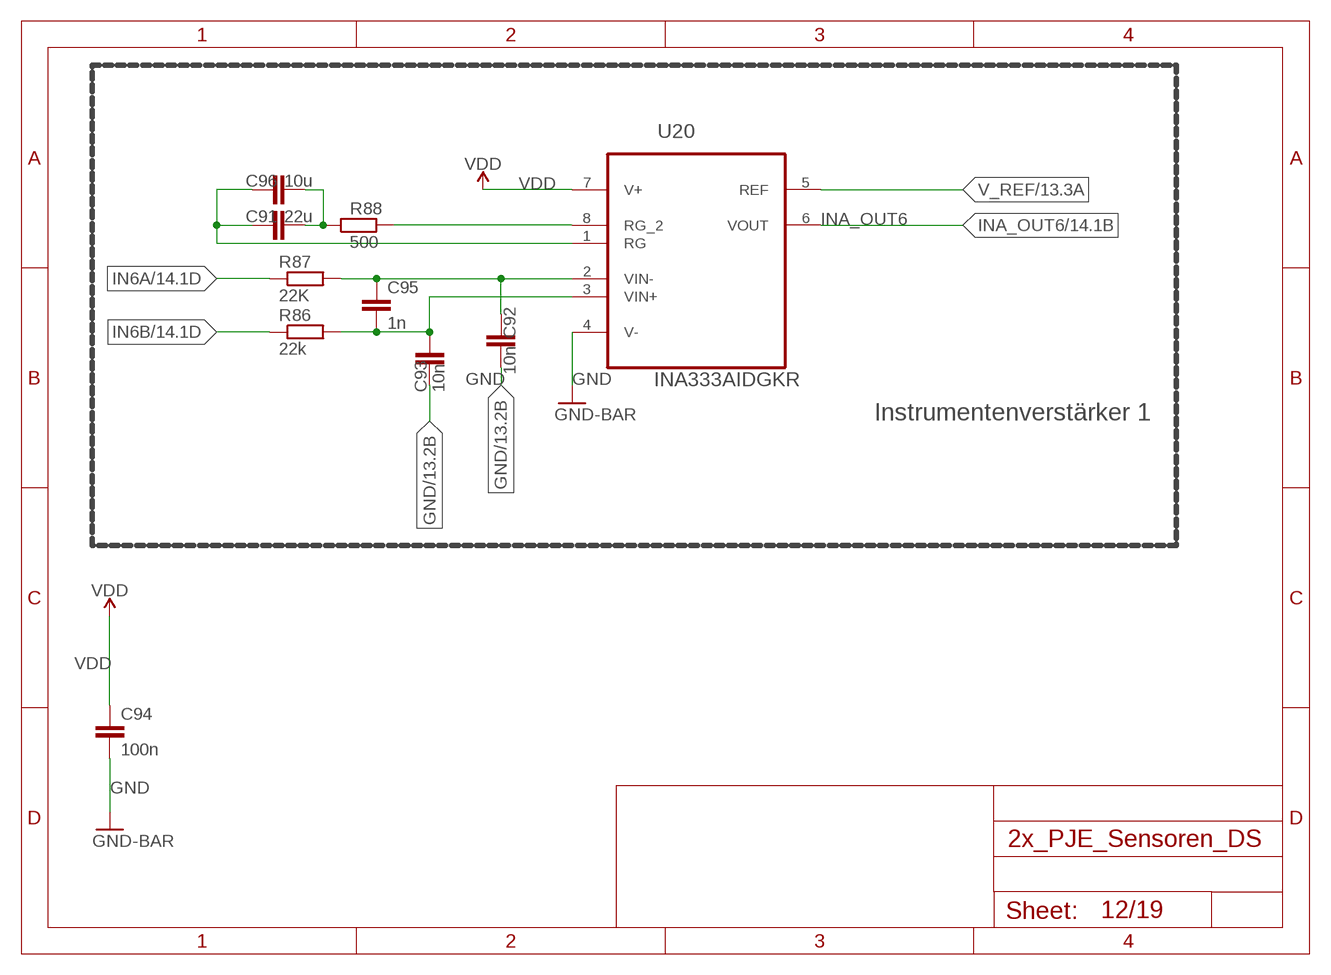
[diagram p11: schematic, sheet 12]

### Parts
C91  22u  C-EUC0603  [C0603]
C92  10n  C-EUC0603  [C0603]
C93  10n  C-EUC0603  [C0603]
C94  100n  C-EUC0603  [C0603]
C95  1n  C-EUC0603  [C0603]
C96  10u  C-EUC0603  [C0603]
R86  22k  R-EU_R0603  [R0603]
R87  22K  R-EU_R0603  [R0603]
R88  500  R-EU_R0603  [R0603]
U20  INA333AIDGKR  [SOP65P490X110-8N]

### Nets
GND: C92.2 C93.2 C94.2 U20.4(V-) ; supply symbol labelled GND-BAR ; also sheet 1,2,3,4,5,6,7,8,9,10,11,13,14,15,16,17,18,19
IN6A: R87.1 ; also sheet 14
IN6B: R86.1 ; also sheet 14
INA_OUT6: U20.6(VOUT) ; also sheet 14
N$100: C91.2 C96.2 R88.1
N$101: R88.2 U20.8(RG_2)
N$102: C91.1 C96.1 U20.1(RG)
N$103: C92.1 C95.1 R87.2 U20.2(VIN-)
N$104: C93.1 C95.2 R86.2 U20.3(VIN+)
V_REF: U20.5(REF) ; also sheet 3,4,5,6,7,8,9,10,11,13,14
VDD: C94.1 U20.7(V+) ; also sheet 1,2,3,4,5,6,7,8,9,10,11,13,14,15,16,17,18,19

### Notes on the sheet
- Instrumentenverstärker 1

## Sheet 13 of 19
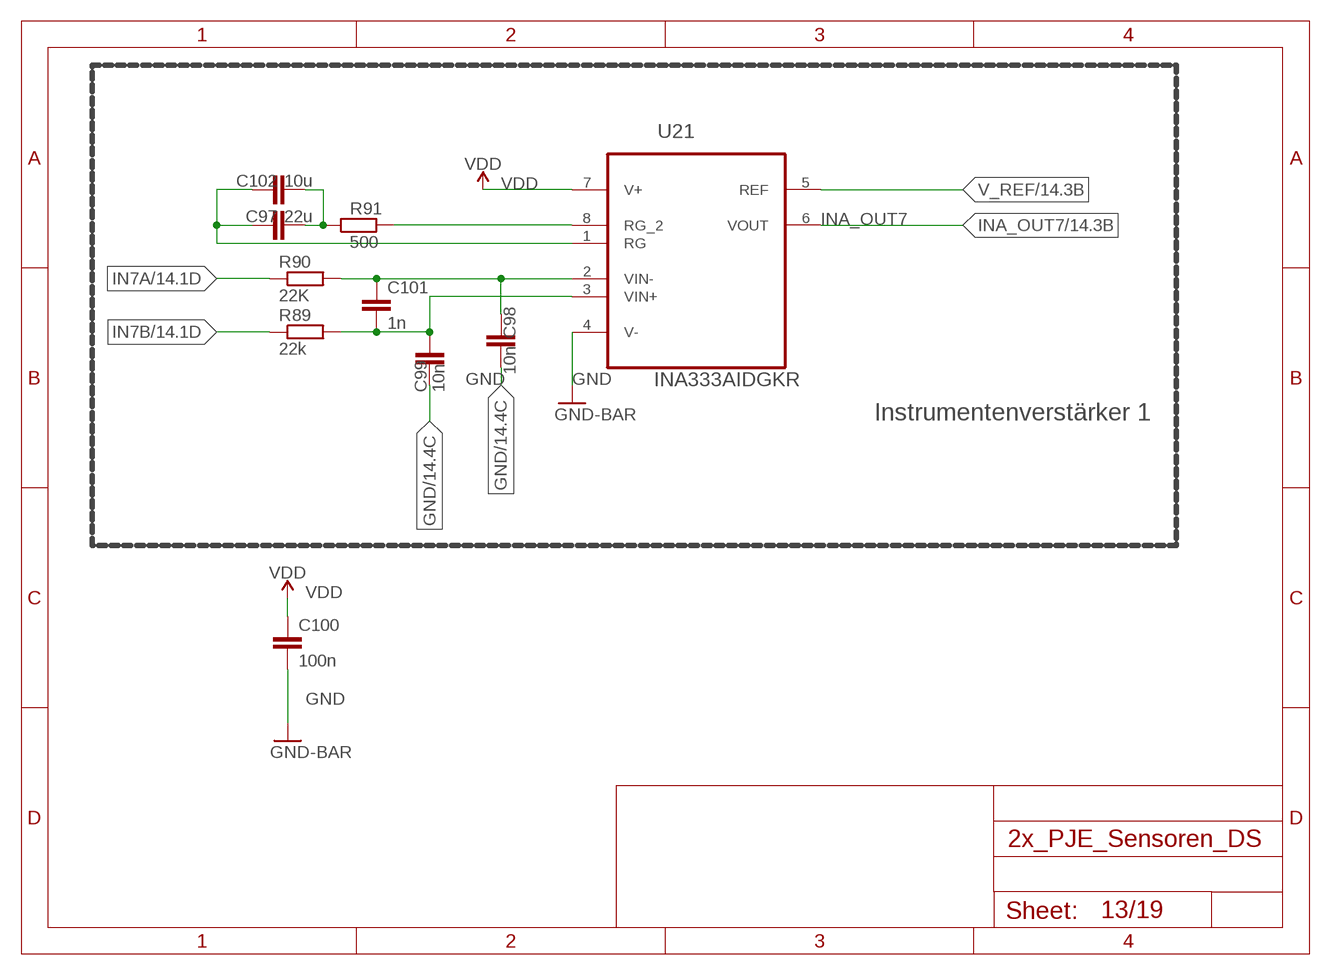
[diagram p12: schematic, sheet 13]

### Parts
C97  22u  C-EUC0603  [C0603]
C98  10n  C-EUC0603  [C0603]
C99  10n  C-EUC0603  [C0603]
C100  100n  C-EUC0603  [C0603]
C101  1n  C-EUC0603  [C0603]
C102  10u  C-EUC0603  [C0603]
R89  22k  R-EU_R0603  [R0603]
R90  22K  R-EU_R0603  [R0603]
R91  500  R-EU_R0603  [R0603]
U21  INA333AIDGKR  [SOP65P490X110-8N]

### Nets
GND: C98.2 C99.2 C100.2 U21.4(V-) ; supply symbol labelled GND-BAR ; also sheet 1,2,3,4,5,6,7,8,9,10,11,12,14,15,16,17,18,19
IN7A: R90.1 ; also sheet 14
IN7B: R89.1 ; also sheet 14
INA_OUT7: U21.6(VOUT) ; also sheet 14
N$105: C97.2 C102.2 R91.1
N$106: R91.2 U21.8(RG_2)
N$107: C97.1 C102.1 U21.1(RG)
N$108: C98.1 C101.1 R90.2 U21.2(VIN-)
N$109: C99.1 C101.2 R89.2 U21.3(VIN+)
V_REF: U21.5(REF) ; also sheet 3,4,5,6,7,8,9,10,11,12,14
VDD: C100.1 U21.7(V+) ; also sheet 1,2,3,4,5,6,7,8,9,10,11,12,14,15,16,17,18,19

### Notes on the sheet
- Instrumentenverstärker 1

## Sheet 14 of 19
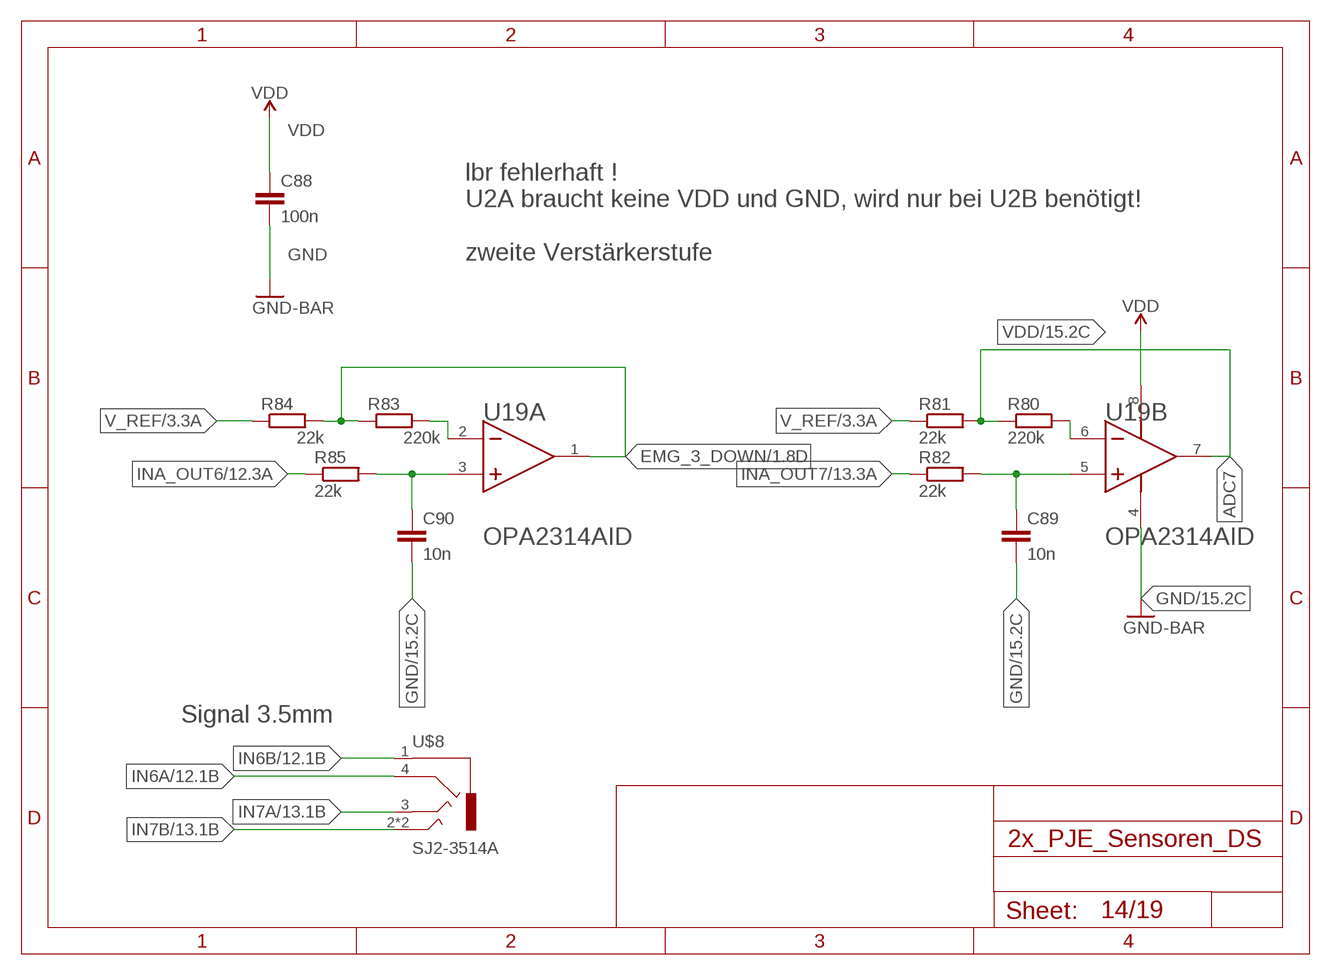
[diagram p13: schematic, sheet 14]

### Parts
C88  100n  C-EUC0603  [C0603]
C89  10n  C-EUC0603  [C0603]
C90  10n  C-EUC0603  [C0603]
R80  220k  R-EU_R0603  [R0603]
R81  22k  R-EU_R0603  [R0603]
R82  22k  R-EU_R0603  [R0603]
R83  220k  R-EU_R0603  [R0603]
R84  22k  R-EU_R0603  [R0603]
R85  22k  R-EU_R0603  [R0603]
U19  TEXAS_INSTRUMENTS_OPA2314AIDTEXAS_INSTRUMENTS_OPA2314AID_0_0  [TEXAS_INSTRUMENTS_OPA2314AID_0]
U$8  SJ2-3514A  [USR_SJ2-4514A]

### Nets
ADC7: R80.1 R81.2 U19.7(B:OUT_B)
EMG_3_DOWN: R83.1 R84.2 U19.1(A:OUT_A) ; also sheet 1
GND: C88.2 C89.2 C90.2 U19.4(B:V-) ; supply symbol labelled GND-BAR ; also sheet 1,2,3,4,5,6,7,8,9,10,11,12,13,15,16,17,18,19
IN6A: U$8.4 ; also sheet 12
IN6B: U$8.1 ; also sheet 12
IN7A: U$8.3 ; also sheet 13
IN7B: U$8.2 U$8.2_2 ; also sheet 13
INA_OUT6: R85.1 ; also sheet 12
INA_OUT7: R82.1 ; also sheet 13
N$110: C89.1 R82.2 U19.5(B:IN_B+)
N$111: R80.2 U19.6(B:IN_B-)
N$112: C90.1 R85.2 U19.3(A:IN_A+)
N$113: R83.2 U19.2(A:IN_A-)
V_REF: R81.1 R84.1 ; also sheet 3,4,5,6,7,8,9,10,11,12,13
VDD: C88.1 U19.8(B:V+) ; also sheet 1,2,3,4,5,6,7,8,9,10,11,12,13,15,16,17,18,19

### Notes on the sheet
- lbr fehlerhaft !
  U2A braucht keine VDD und GND, wird nur bei U2B benötigt!
  
  zweite Verstärkerstufe
- Signal 3.5mm

## Sheet 15 of 19
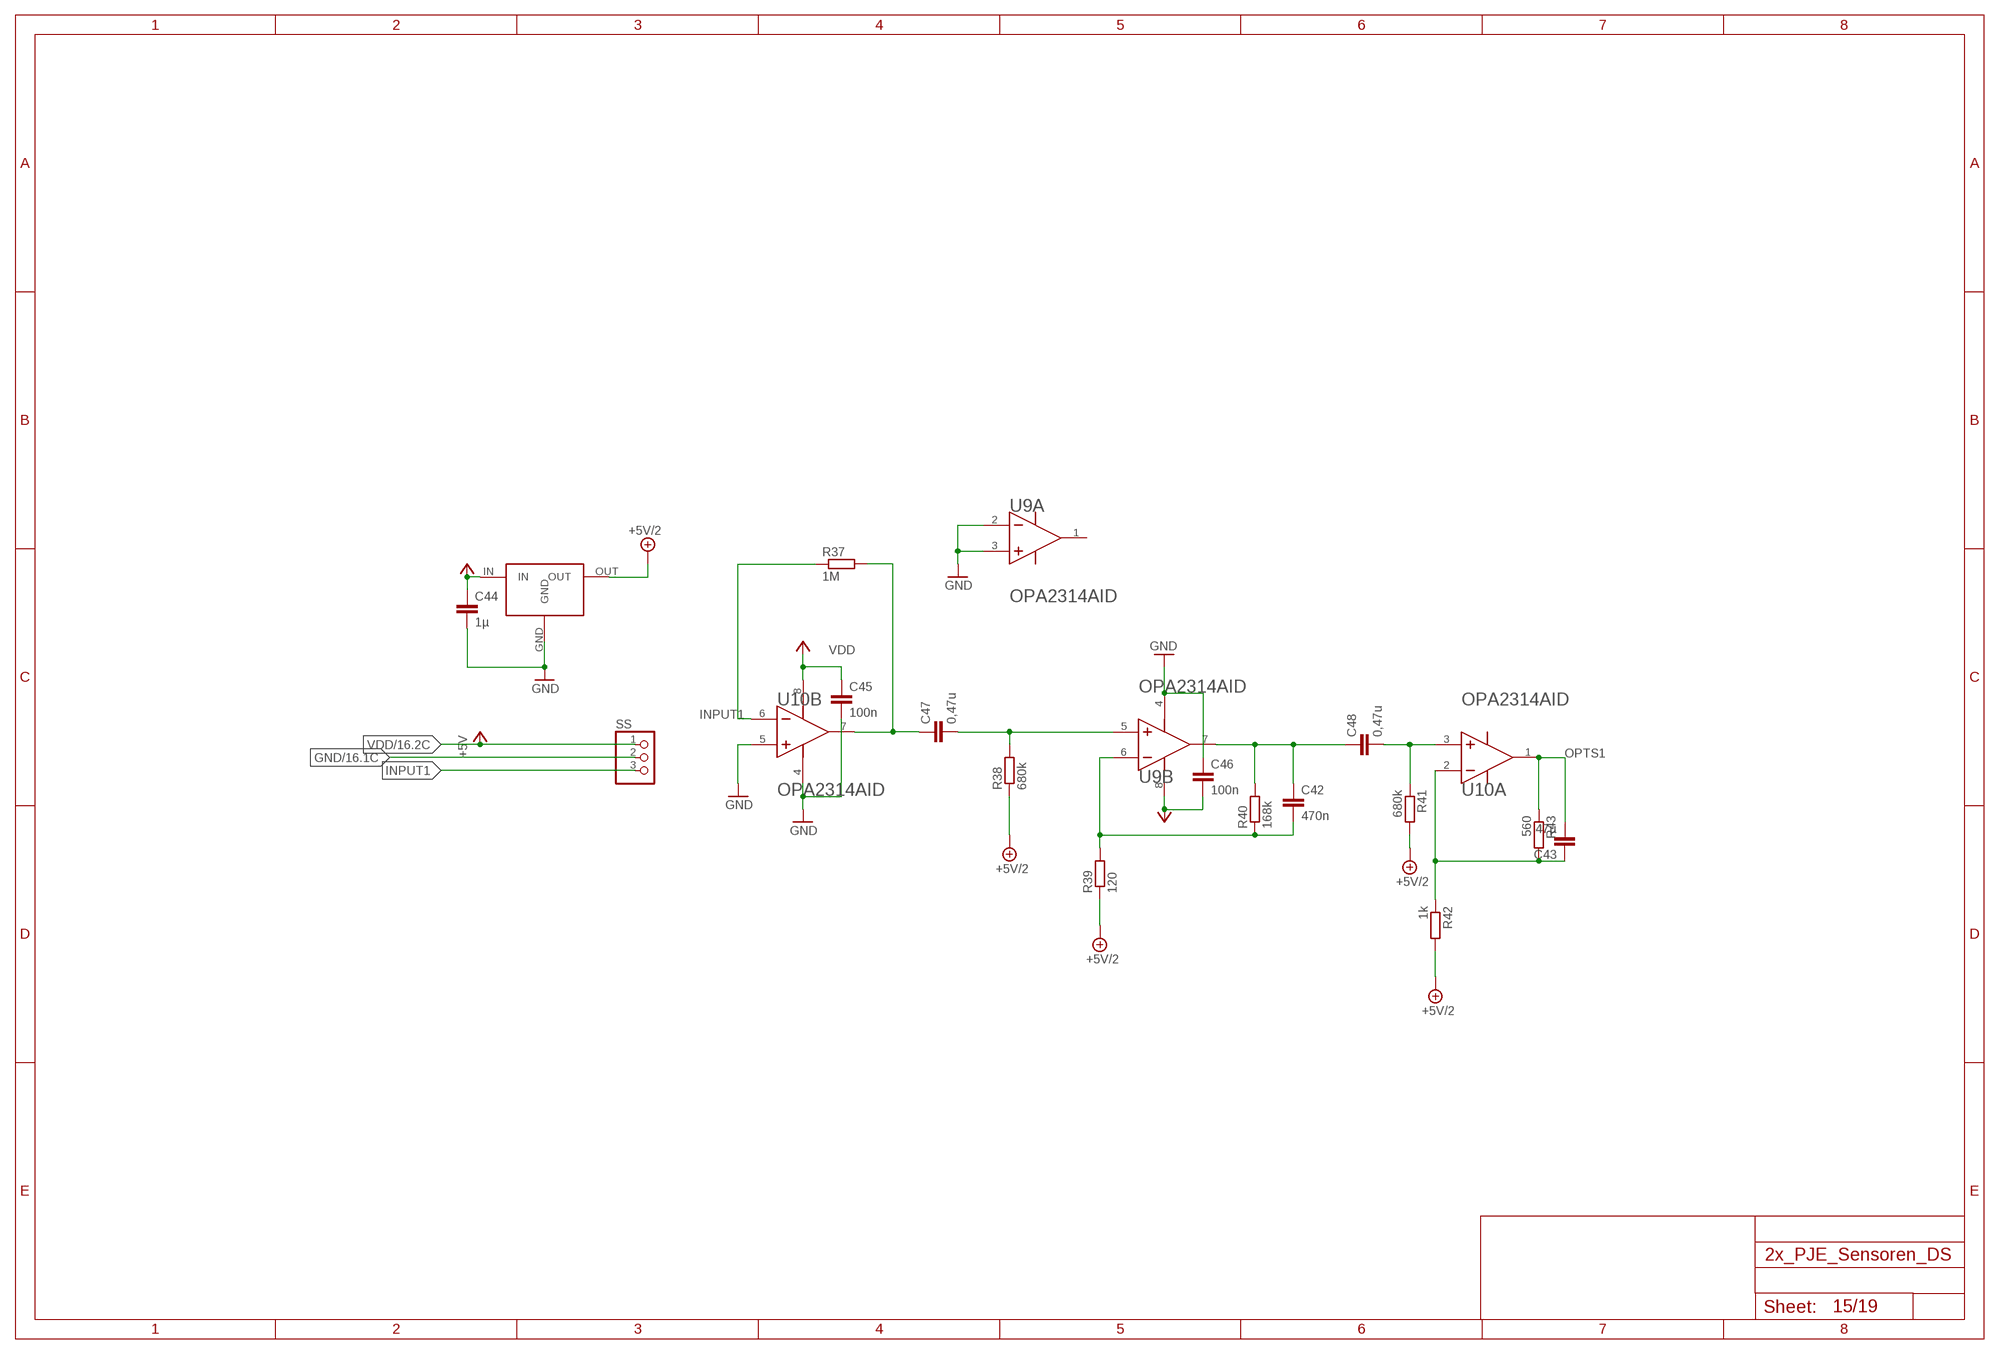
[diagram p14: schematic, sheet 15]

### Parts
C42  470n  C-EUC0603  [C0603]
C43  47µ  C-EUC0603  [C0603]
C44  1µ  C-EUC0603  [C0603]
C45  100n  C-EUC0603  [C0603]
C46  100n  C-EUC0603  [C0603]
C47  0,47u  C-EUC0603  [C0603]
C48  0,47u  C-EUC0603  [C0603]
R37  1M  R-EU_R0603  [R0603]
R38  680k  R-EU_R0603  [R0603]
R39  120  R-EU_R0603  [R0603]
R40  168k  R-EU_R0603  [R0603]
R41  680k  R-EU_R0603  [R0603]
R42  1k  R-EU_R0603  [R0603]
R43  560  R-EU_R0603  [R0603]
SS  PINHD-1X3  [1X03]
U9  TEXAS_INSTRUMENTS_OPA2314AIDTEXAS_INSTRUMENTS_OPA2314AID_0_0  [TEXAS_INSTRUMENTS_OPA2314AID_0]
U10  TEXAS_INSTRUMENTS_OPA2314AIDTEXAS_INSTRUMENTS_OPA2314AID_0_0  [TEXAS_INSTRUMENTS_OPA2314AID_0]
U$5  MAX6018X_MAX6018X  [MAX6018X_SOT-3]

### Nets
+5V/2: R38.1 R39.1 R41.2 R42.2 U$5.OUT ; also sheet 16,17,18,19
GND: C44.2 C45.2 C46.1 SS.2 U9.2(A:IN_A-) U9.3(A:IN_A+) U9.4(B:V-) U10.4(B:V-) U10.5(B:IN_B+) U$5.GND ; also sheet 1,2,3,4,5,6,7,8,9,10,11,12,13,14,16,17,18,19
INPUT1: R37.1 SS.3 U10.6(B:IN_B-)
N$2: C47.2 R38.2 U9.5(B:IN_B+)
N$36: C42.2 R39.2 R40.1 U9.6(B:IN_B-)
N$37: C42.1 C48.1 R40.2 U9.7(B:OUT_B)
N$38: C48.2 R41.1 U10.3(A:IN_A+)
N$39: C47.1 R37.2 U10.7(B:OUT_B)
N$40: C43.1 R42.1 R43.2 U10.2(A:IN_A-)
OPTS1: C43.2 R43.1 U10.1(A:OUT_A) ; also sheet 1
VDD: C44.1 C45.1 C46.2 SS.1 U9.8(B:V+) U10.8(B:V+) U$5.IN ; supply symbol labelled +5V ; also sheet 1,2,3,4,5,6,7,8,9,10,11,12,13,14,16,17,18,19
Unconnected: U9.1(A:OUT_A)

## Sheet 16 of 19
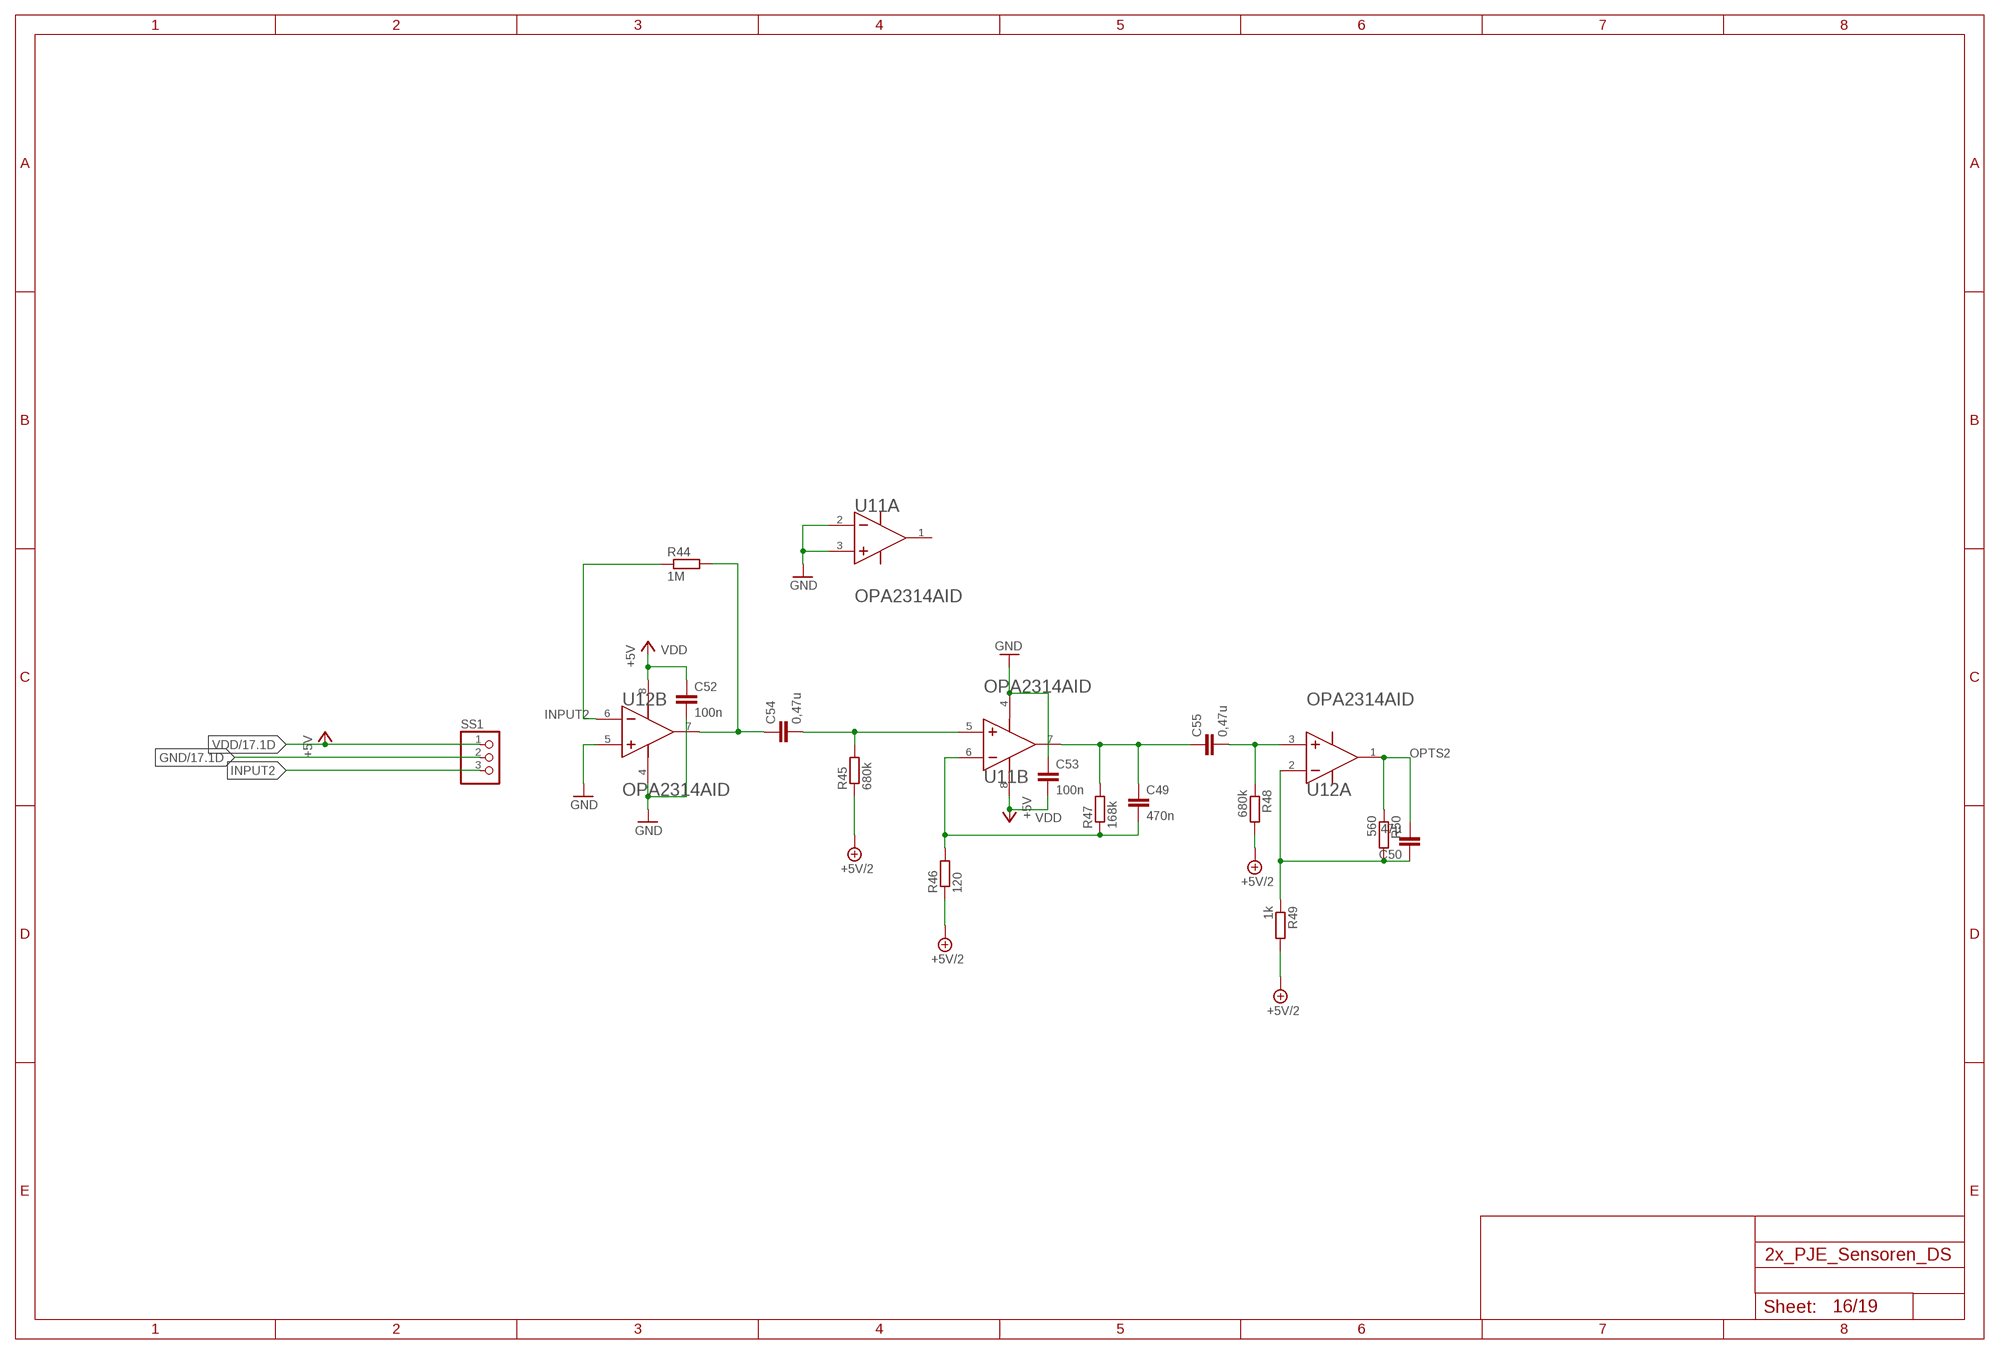
[diagram p15: schematic, sheet 16]

### Parts
C49  470n  C-EUC0603  [C0603]
C50  47µ  C-EUC0603  [C0603]
C52  100n  C-EUC0603  [C0603]
C53  100n  C-EUC0603  [C0603]
C54  0,47u  C-EUC0603  [C0603]
C55  0,47u  C-EUC0603  [C0603]
R44  1M  R-EU_R0603  [R0603]
R45  680k  R-EU_R0603  [R0603]
R46  120  R-EU_R0603  [R0603]
R47  168k  R-EU_R0603  [R0603]
R48  680k  R-EU_R0603  [R0603]
R49  1k  R-EU_R0603  [R0603]
R50  560  R-EU_R0603  [R0603]
SS1  PINHD-1X3  [1X03]
U11  TEXAS_INSTRUMENTS_OPA2314AIDTEXAS_INSTRUMENTS_OPA2314AID_0_0  [TEXAS_INSTRUMENTS_OPA2314AID_0]
U12  TEXAS_INSTRUMENTS_OPA2314AIDTEXAS_INSTRUMENTS_OPA2314AID_0_0  [TEXAS_INSTRUMENTS_OPA2314AID_0]

### Nets
+5V/2: R45.1 R46.1 R48.2 R49.2 ; also sheet 15,17,18,19
GND: C52.2 C53.1 SS1.2 U11.2(A:IN_A-) U11.3(A:IN_A+) U11.4(B:V-) U12.4(B:V-) U12.5(B:IN_B+) ; also sheet 1,2,3,4,5,6,7,8,9,10,11,12,13,14,15,17,18,19
INPUT2: R44.1 SS1.3 U12.6(B:IN_B-)
N$41: C54.2 R45.2 U11.5(B:IN_B+)
N$42: C49.2 R46.2 R47.1 U11.6(B:IN_B-)
N$43: C49.1 C55.1 R47.2 U11.7(B:OUT_B)
N$44: C55.2 R48.1 U12.3(A:IN_A+)
N$45: C54.1 R44.2 U12.7(B:OUT_B)
N$46: C50.1 R49.1 R50.2 U12.2(A:IN_A-)
OPTS2: C50.2 R50.1 U12.1(A:OUT_A) ; also sheet 1
VDD: C52.1 C53.2 SS1.1 U11.8(B:V+) U12.8(B:V+) ; supply symbol labelled +5V ; also sheet 1,2,3,4,5,6,7,8,9,10,11,12,13,14,15,17,18,19
Unconnected: U11.1(A:OUT_A)

## Sheet 17 of 19
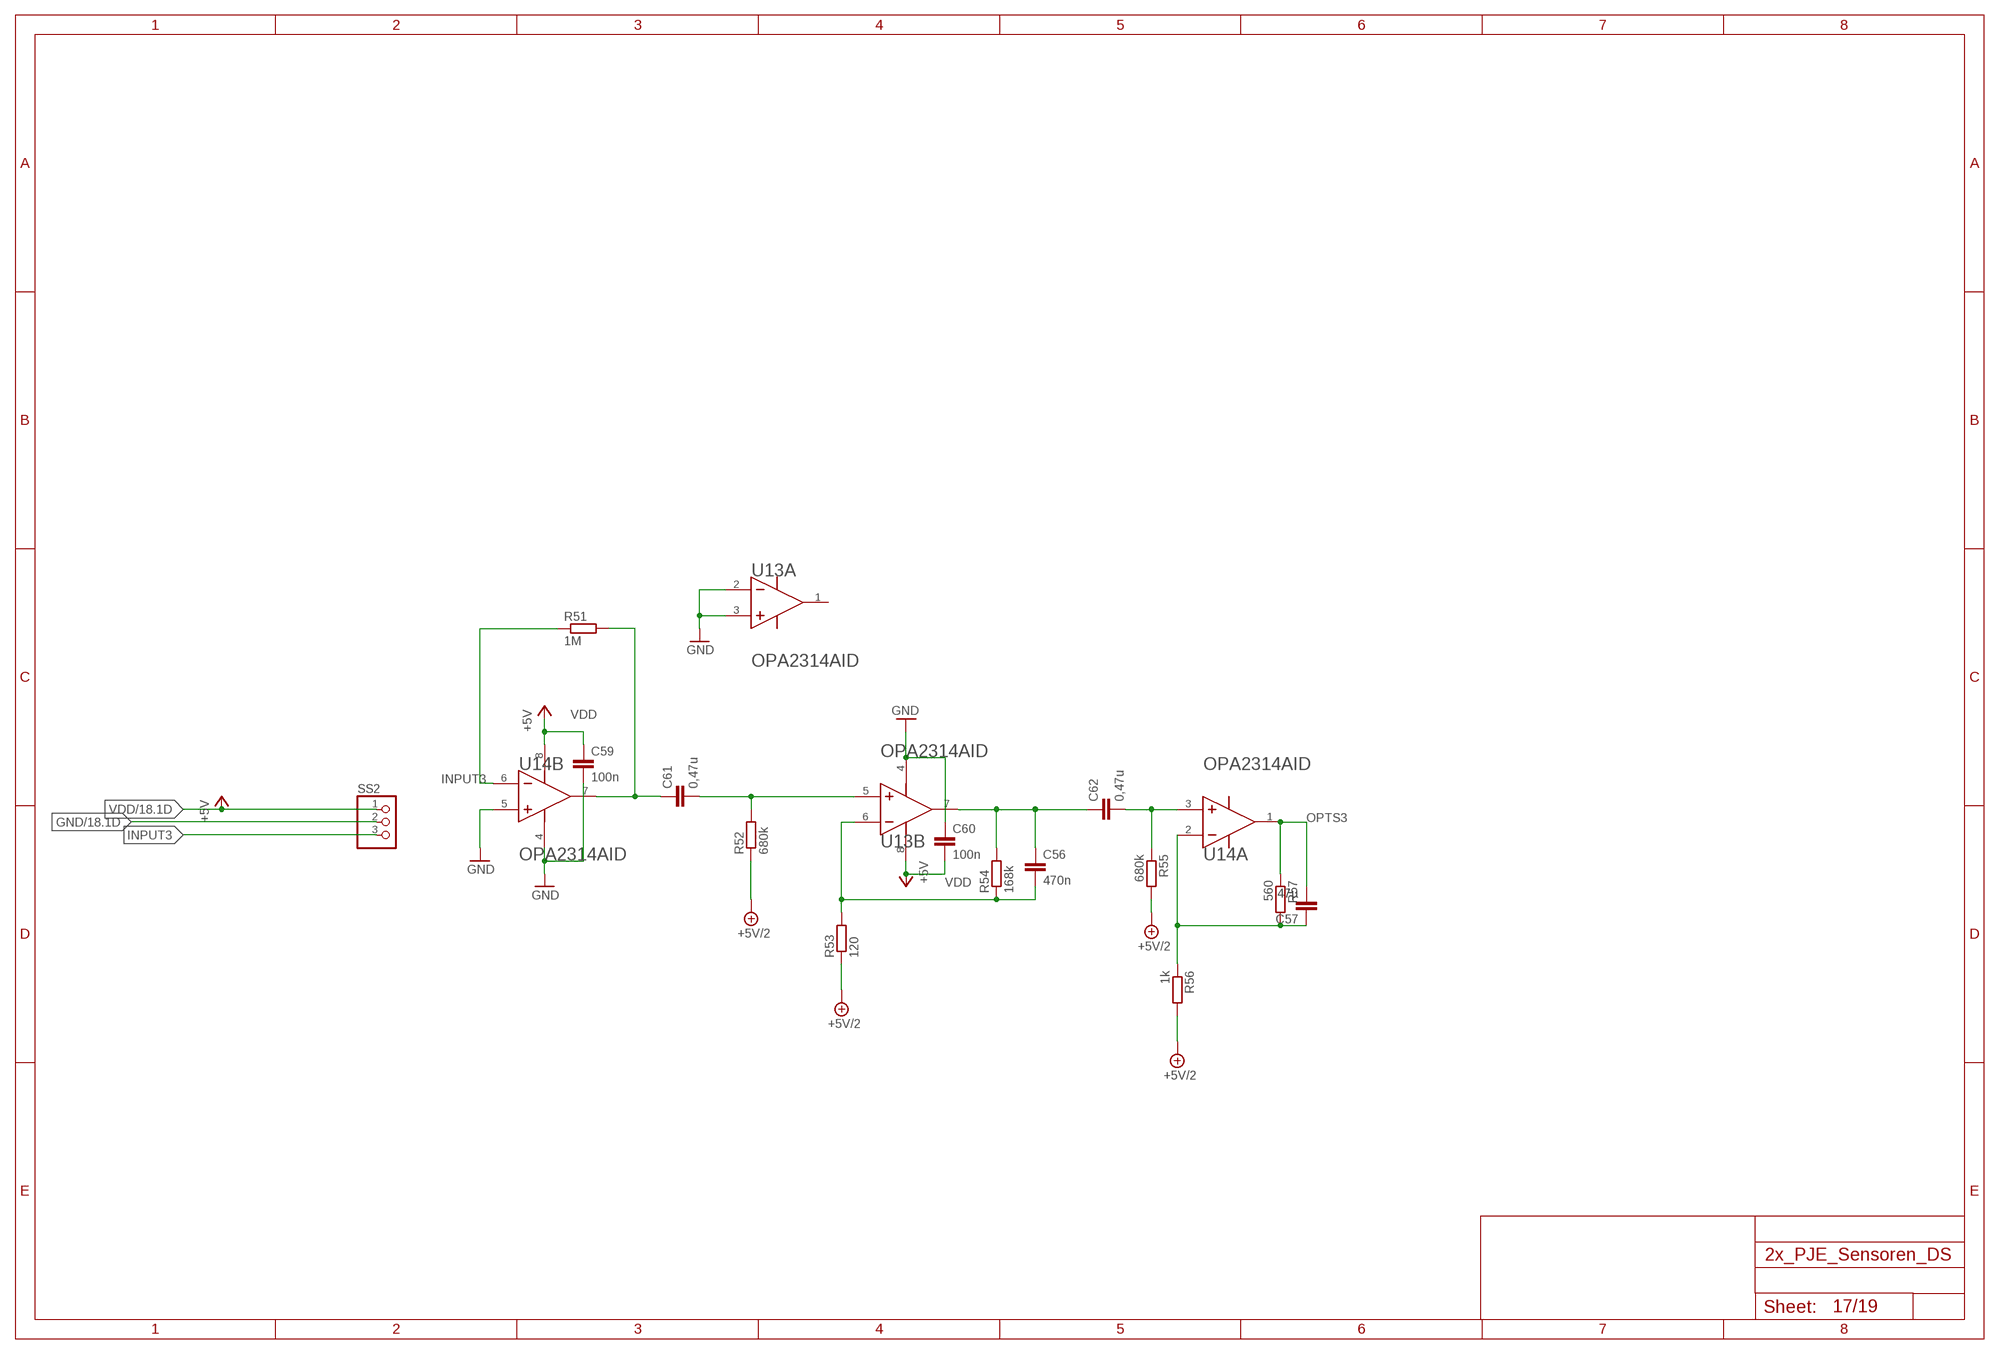
[diagram p16: schematic, sheet 17]

### Parts
C56  470n  C-EUC0603  [C0603]
C57  47µ  C-EUC0603  [C0603]
C59  100n  C-EUC0603  [C0603]
C60  100n  C-EUC0603  [C0603]
C61  0,47u  C-EUC0603  [C0603]
C62  0,47u  C-EUC0603  [C0603]
R51  1M  R-EU_R0603  [R0603]
R52  680k  R-EU_R0603  [R0603]
R53  120  R-EU_R0603  [R0603]
R54  168k  R-EU_R0603  [R0603]
R55  680k  R-EU_R0603  [R0603]
R56  1k  R-EU_R0603  [R0603]
R57  560  R-EU_R0603  [R0603]
SS2  PINHD-1X3  [1X03]
U13  TEXAS_INSTRUMENTS_OPA2314AIDTEXAS_INSTRUMENTS_OPA2314AID_0_0  [TEXAS_INSTRUMENTS_OPA2314AID_0]
U14  TEXAS_INSTRUMENTS_OPA2314AIDTEXAS_INSTRUMENTS_OPA2314AID_0_0  [TEXAS_INSTRUMENTS_OPA2314AID_0]

### Nets
+5V/2: R52.1 R53.1 R55.2 R56.2 ; also sheet 15,16,18,19
GND: C59.2 C60.1 SS2.2 U13.2(A:IN_A-) U13.3(A:IN_A+) U13.4(B:V-) U14.4(B:V-) U14.5(B:IN_B+) ; also sheet 1,2,3,4,5,6,7,8,9,10,11,12,13,14,15,16,18,19
INPUT3: R51.1 SS2.3 U14.6(B:IN_B-)
N$47: C61.2 R52.2 U13.5(B:IN_B+)
N$48: C56.2 R53.2 R54.1 U13.6(B:IN_B-)
N$49: C56.1 C62.1 R54.2 U13.7(B:OUT_B)
N$50: C62.2 R55.1 U14.3(A:IN_A+)
N$51: C61.1 R51.2 U14.7(B:OUT_B)
N$52: C57.1 R56.1 R57.2 U14.2(A:IN_A-)
OPTS3: C57.2 R57.1 U14.1(A:OUT_A) ; also sheet 1
VDD: C59.1 C60.2 SS2.1 U13.8(B:V+) U14.8(B:V+) ; supply symbol labelled +5V ; also sheet 1,2,3,4,5,6,7,8,9,10,11,12,13,14,15,16,18,19
Unconnected: U13.1(A:OUT_A)

## Sheet 18 of 19
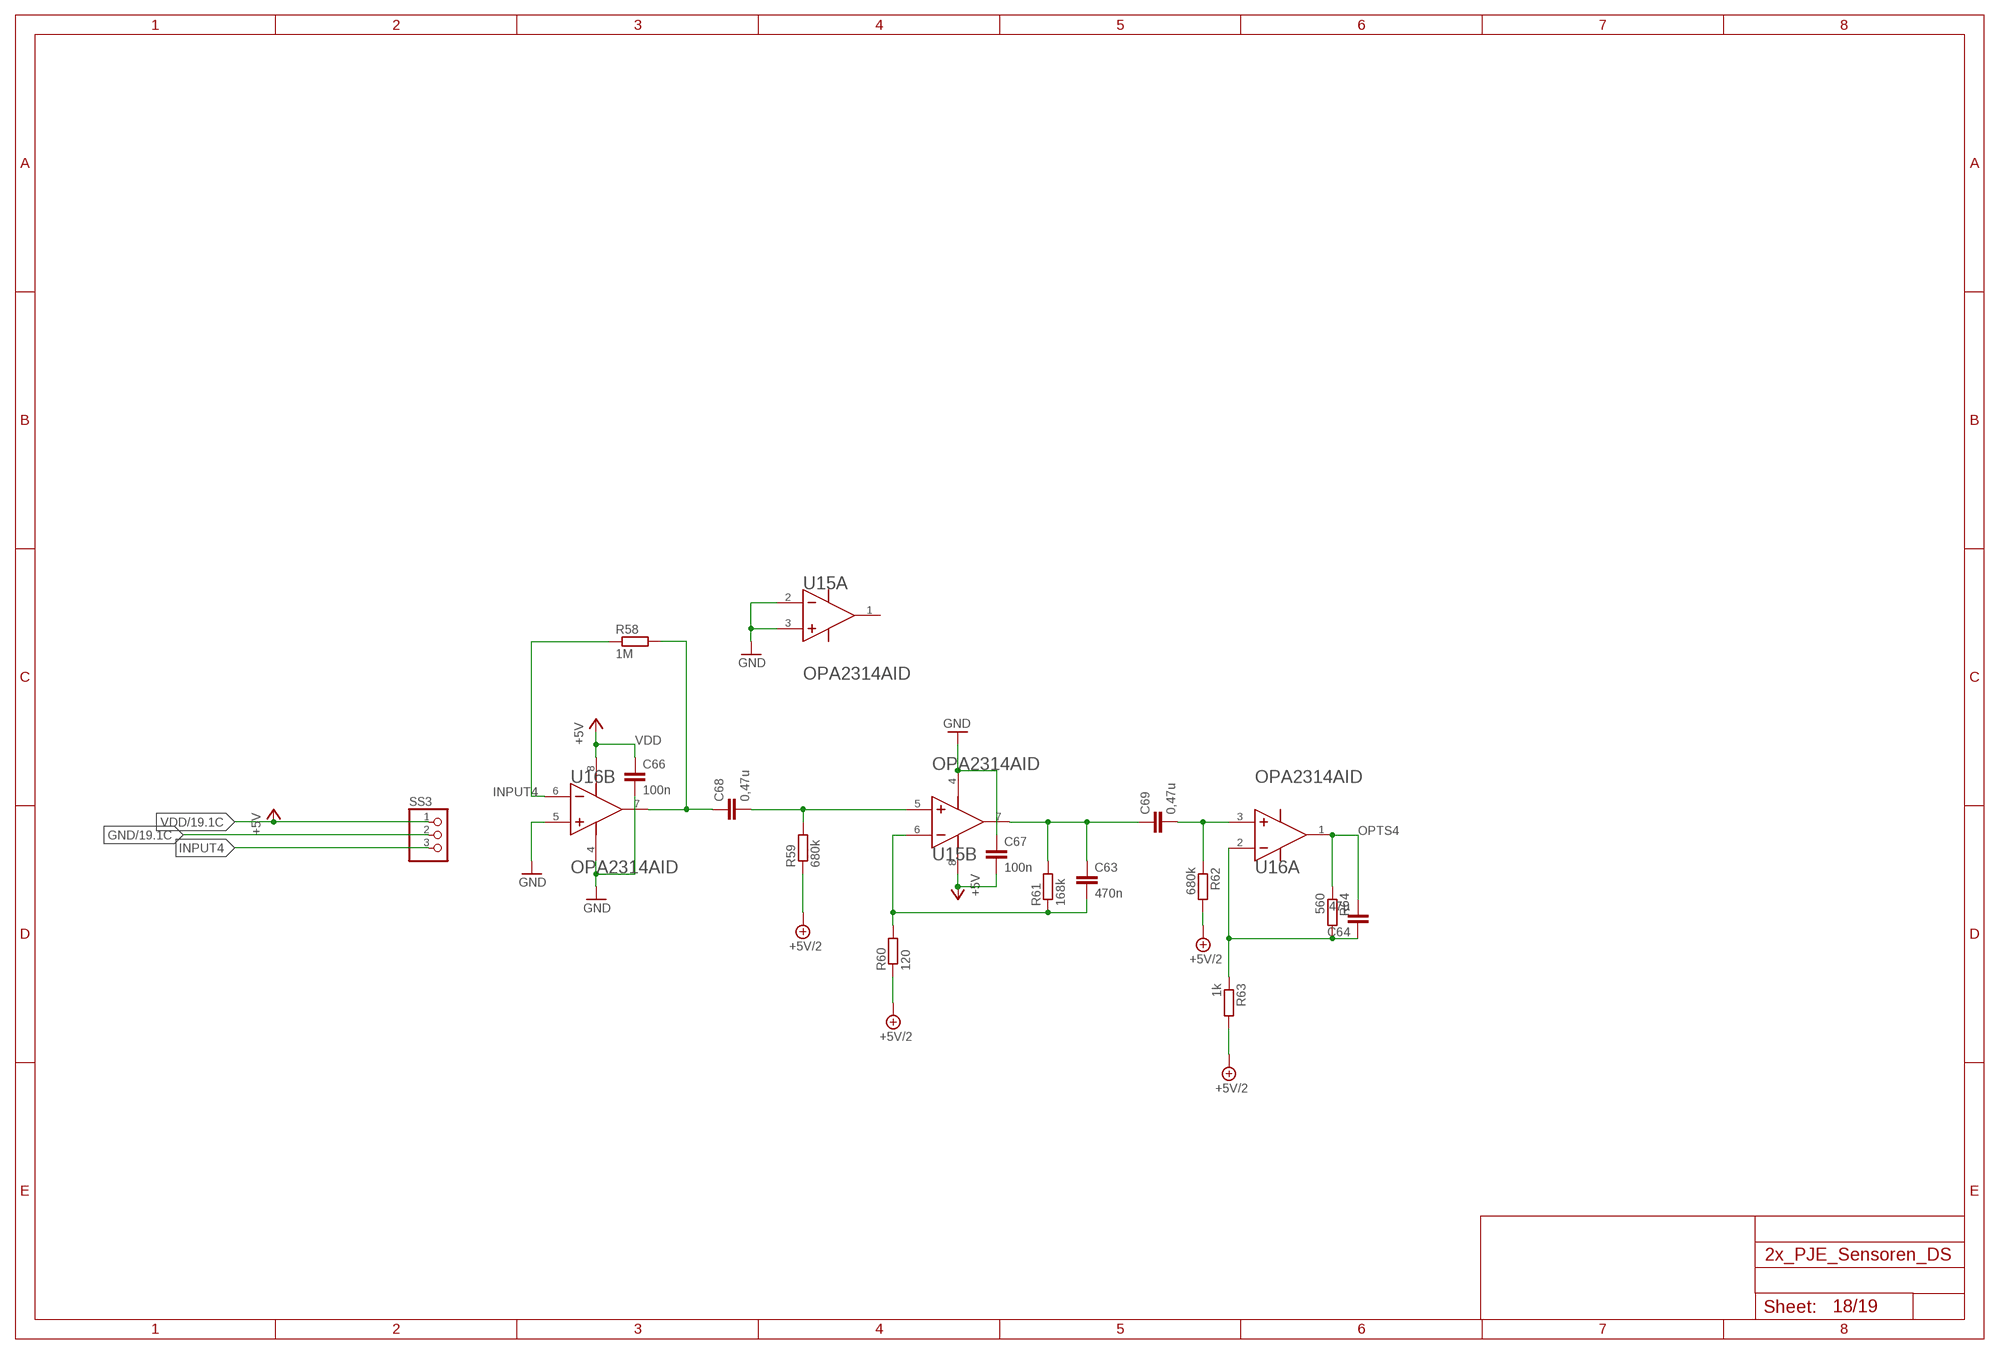
[diagram p17: schematic, sheet 18]

### Parts
C63  470n  C-EUC0603  [C0603]
C64  47µ  C-EUC0603  [C0603]
C66  100n  C-EUC0603  [C0603]
C67  100n  C-EUC0603  [C0603]
C68  0,47u  C-EUC0603  [C0603]
C69  0,47u  C-EUC0603  [C0603]
R58  1M  R-EU_R0603  [R0603]
R59  680k  R-EU_R0603  [R0603]
R60  120  R-EU_R0603  [R0603]
R61  168k  R-EU_R0603  [R0603]
R62  680k  R-EU_R0603  [R0603]
R63  1k  R-EU_R0603  [R0603]
R64  560  R-EU_R0603  [R0603]
SS3  PINHD-1X3  [1X03]
U15  TEXAS_INSTRUMENTS_OPA2314AIDTEXAS_INSTRUMENTS_OPA2314AID_0_0  [TEXAS_INSTRUMENTS_OPA2314AID_0]
U16  TEXAS_INSTRUMENTS_OPA2314AIDTEXAS_INSTRUMENTS_OPA2314AID_0_0  [TEXAS_INSTRUMENTS_OPA2314AID_0]

### Nets
+5V/2: R59.1 R60.1 R62.2 R63.2 ; also sheet 15,16,17,19
GND: C66.2 C67.1 SS3.2 U15.2(A:IN_A-) U15.3(A:IN_A+) U15.4(B:V-) U16.4(B:V-) U16.5(B:IN_B+) ; also sheet 1,2,3,4,5,6,7,8,9,10,11,12,13,14,15,16,17,19
INPUT4: R58.1 SS3.3 U16.6(B:IN_B-)
N$53: C68.2 R59.2 U15.5(B:IN_B+)
N$54: C63.2 R60.2 R61.1 U15.6(B:IN_B-)
N$55: C63.1 C69.1 R61.2 U15.7(B:OUT_B)
N$56: C69.2 R62.1 U16.3(A:IN_A+)
N$57: C68.1 R58.2 U16.7(B:OUT_B)
N$58: C64.1 R63.1 R64.2 U16.2(A:IN_A-)
OPTS4: C64.2 R64.1 U16.1(A:OUT_A) ; also sheet 1
VDD: C66.1 C67.2 SS3.1 U15.8(B:V+) U16.8(B:V+) ; supply symbol labelled +5V ; also sheet 1,2,3,4,5,6,7,8,9,10,11,12,13,14,15,16,17,19
Unconnected: U15.1(A:OUT_A)

## Sheet 19 of 19
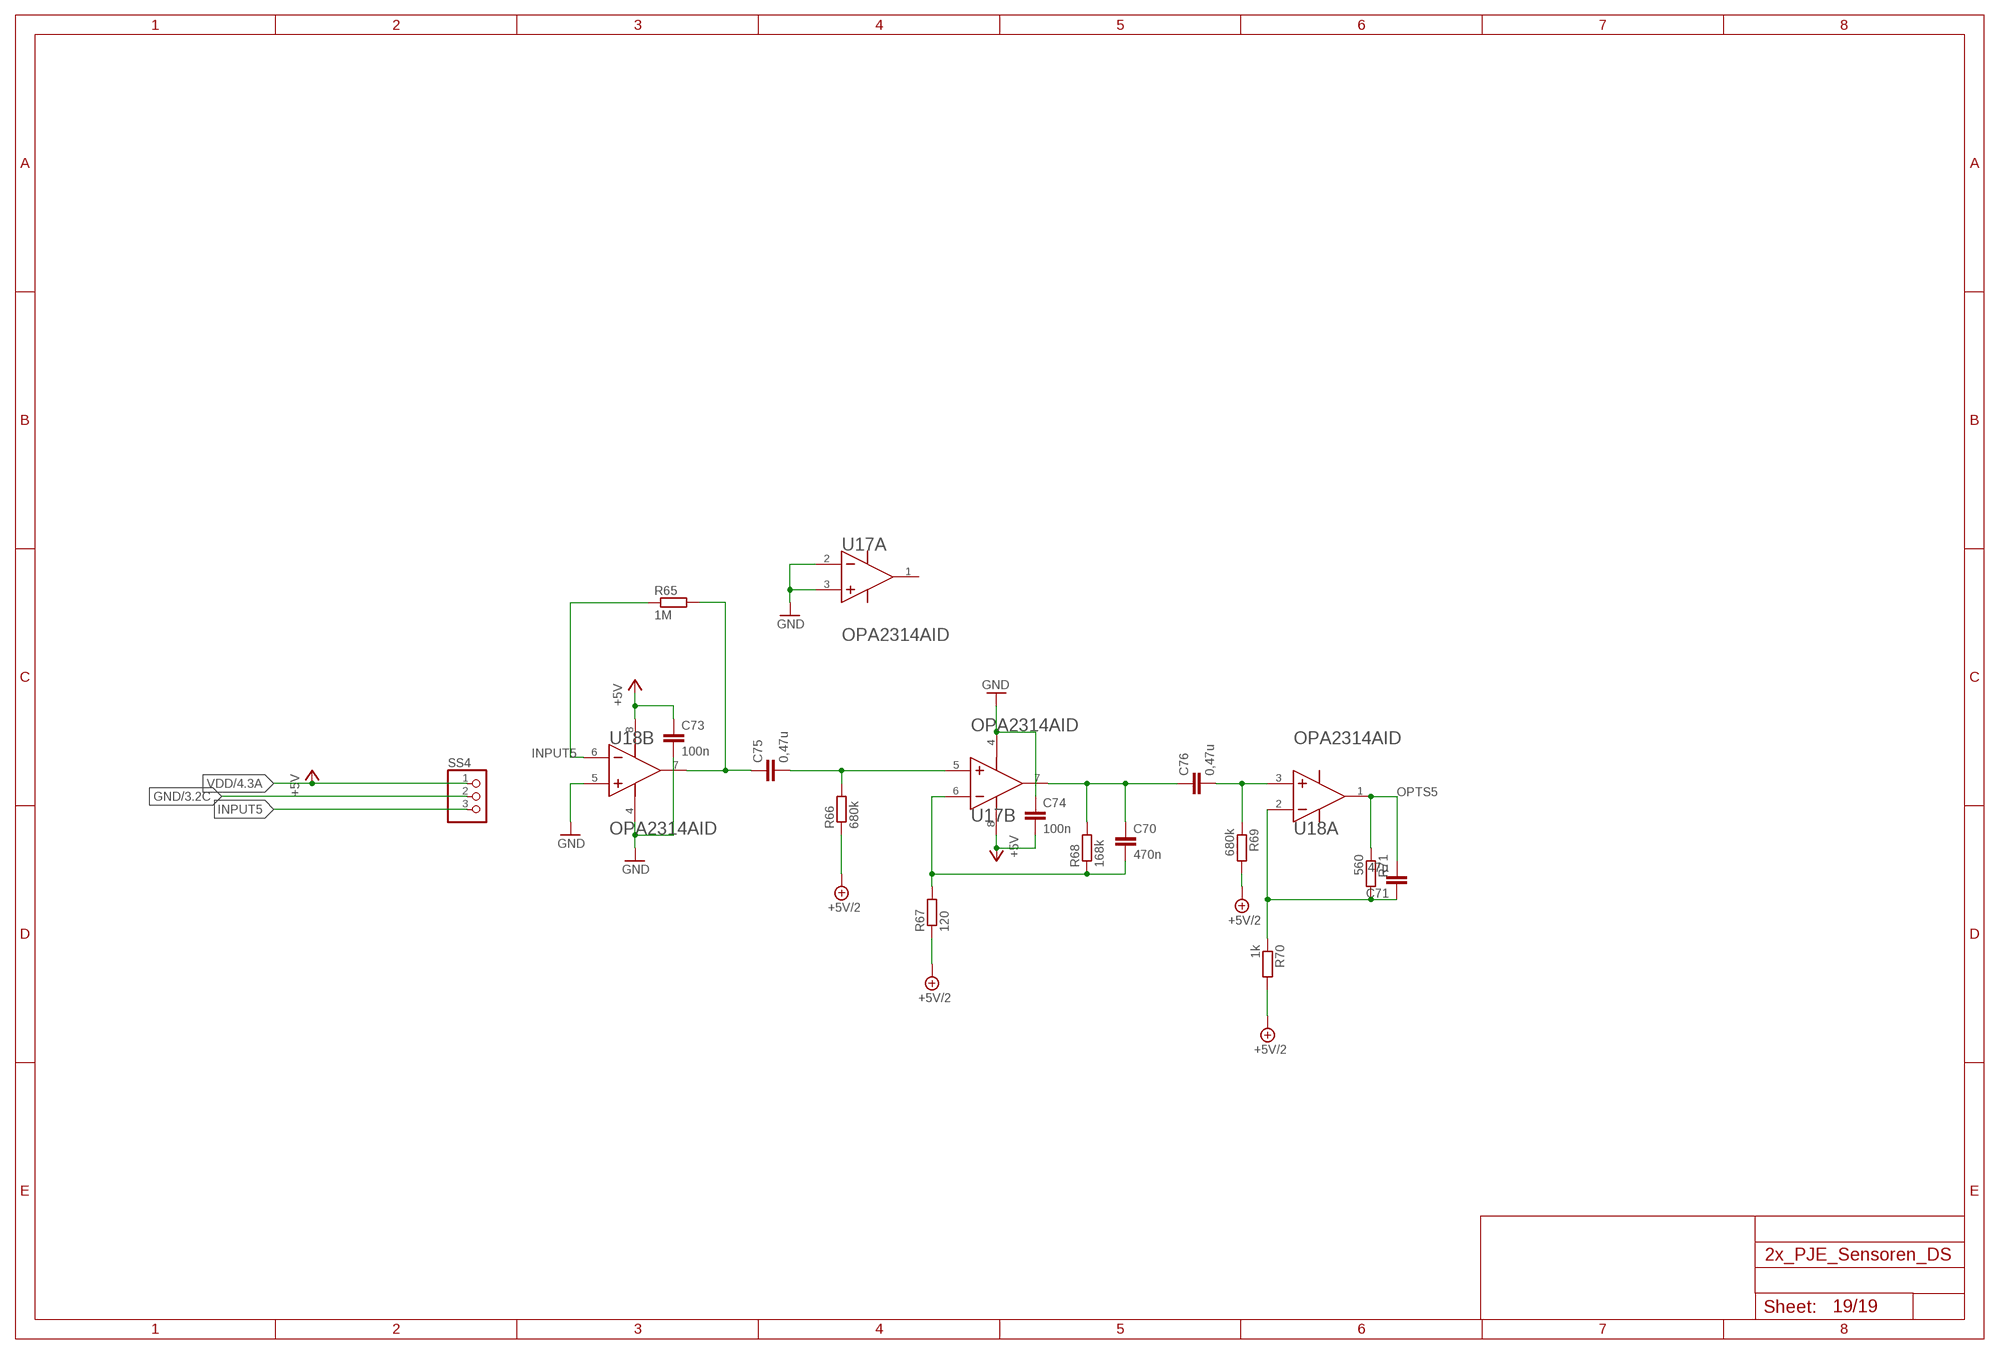
[diagram p18: schematic, sheet 19]

### Parts
C70  470n  C-EUC0603  [C0603]
C71  47µ  C-EUC0603  [C0603]
C73  100n  C-EUC0603  [C0603]
C74  100n  C-EUC0603  [C0603]
C75  0,47u  C-EUC0603  [C0603]
C76  0,47u  C-EUC0603  [C0603]
R65  1M  R-EU_R0603  [R0603]
R66  680k  R-EU_R0603  [R0603]
R67  120  R-EU_R0603  [R0603]
R68  168k  R-EU_R0603  [R0603]
R69  680k  R-EU_R0603  [R0603]
R70  1k  R-EU_R0603  [R0603]
R71  560  R-EU_R0603  [R0603]
SS4  PINHD-1X3  [1X03]
U17  TEXAS_INSTRUMENTS_OPA2314AIDTEXAS_INSTRUMENTS_OPA2314AID_0_0  [TEXAS_INSTRUMENTS_OPA2314AID_0]
U18  TEXAS_INSTRUMENTS_OPA2314AIDTEXAS_INSTRUMENTS_OPA2314AID_0_0  [TEXAS_INSTRUMENTS_OPA2314AID_0]

### Nets
+5V/2: R66.1 R67.1 R69.2 R70.2 ; also sheet 15,16,17,18
GND: C73.2 C74.1 SS4.2 U17.2(A:IN_A-) U17.3(A:IN_A+) U17.4(B:V-) U18.4(B:V-) U18.5(B:IN_B+) ; also sheet 1,2,3,4,5,6,7,8,9,10,11,12,13,14,15,16,17,18
INPUT5: R65.1 SS4.3 U18.6(B:IN_B-)
N$59: C75.2 R66.2 U17.5(B:IN_B+)
N$60: C70.2 R67.2 R68.1 U17.6(B:IN_B-)
N$61: C70.1 C76.1 R68.2 U17.7(B:OUT_B)
N$62: C76.2 R69.1 U18.3(A:IN_A+)
N$63: C75.1 R65.2 U18.7(B:OUT_B)
N$64: C71.1 R70.1 R71.2 U18.2(A:IN_A-)
OPTS5: C71.2 R71.1 U18.1(A:OUT_A) ; also sheet 1
VDD: C73.1 C74.2 SS4.1 U17.8(B:V+) U18.8(B:V+) ; supply symbol labelled +5V ; also sheet 1,2,3,4,5,6,7,8,9,10,11,12,13,14,15,16,17,18
Unconnected: U17.1(A:OUT_A)

## Power pins joined to a net without a drawn wire
VBAT: U$6.1(MCU:VBAT) U$7.1(MCU:VBAT)
VDD_USB: U$6.48(MCU:VDD_USB) U$7.48(MCU:VDD_USB)

## Library data of the parts
BEMF_CON DREHIMPULS_CON = con-ml:ML6: HARTING; OC_FARNELL: unknown; OC_NEWARK: unknown
BUTTON FINGER_DIRECTION FINGER_SELECT LEARN LEARN_STOP = switch-omron:10-XX: OMRON SWITCH; MPN: B3F-1000; OC_FARNELL: 176432; OC_NEWARK: 36M3542
C1-C50 C52-C102 = rcl:C-EU: CAPACITOR, European symbol; SPICEPREFIX: C
C51 C103 = rcl:CPOL-EU: POLARIZED CAPACITOR, European symbol; SPICEPREFIX: C
J1 J2 = SparkFun-Connectors:CONN_02: Multi connection point. Often used as Generic Header-pin footprint for 0.1 inch spaced/style header connections On any of the 0.1 inch spaced packages, you can populate with these: Break Away Headers - Straight <https://www.sparkfun.com/products/116> (PRT-00116) Break Away Male Headers - Right Angle <https://www.sparkfun.com/products/553> (PRT-00553) Female Headers <https://www.sparkfun.com/products/115> (PRT-00115) Break Away Headers - Machine Pin <https://www.sparkfun.com/products/117> (PRT-00117) Break Away Female Headers - Swiss Machine Pin <https://www.sparkfun.com/products/743> (PRT-00743) For SCREWTERMINALS and SPRING TERMINALS visit here: Screw Terimnals on SparkFun.com <https://www.sparkfun.com/search/results?term=Screw+Terminals> (5mm/3.5mm/2.54mm spacing) This device is also useful as a general connection point to wire up your design to another part of your project. Our various solder wires solder well into these plated through hole pads. Hook-Up Wire - Assortment (Stranded, 22 AWG) <https://www.sparkfun.com/products/11375> (PRT-11375) Hook-Up Wire - Assortment (Solid Core, 22 AWG) <https://www.sparkfun.com/products/11367> (PRT-11367) View the entire wire category on our website here <https://www.sparkfun.com/categories/141> Special notes: Molex polarized connector foot print use with: PRT-08233 with associated crimp pins and housings. 2.54_SCREWTERM for use with PRT-10571. 3.5mm Screw Terminal footprints for PRT-08084 5mm Screw Terminal footprints for use with PRT-08432; SF_ID: PRT-09918
JP1-JP4 = adafruit:PINHD-1X1: Pin header 1x1 for 0.1" spacing With round pins
LED1-LED6 = led:LED: LED OSRAM: - CHIPLED LG R971, LG N971, LY N971, LG Q971, LY Q971, LO R971, LY R971 LH N974, LH R974 LS Q976, LO Q976, LY Q976 LO Q996 - Hyper CHIPLED LW Q18S LB Q993, LB Q99A, LB R99A - SideLED LS A670, LO A670, LY A670, LG A670, LP A670 LB A673, LV A673, LT A673, LW A673 LH A674 LY A675 LS A676, LA A676, LO A676, LY A676, LW A676 LS A679, LY A679, LG A679 - Hyper Micro SIDELED® LS Y876, LA Y876, LO Y876, LY Y876 LT Y87S - SmartLED LW L88C, LW L88S LB L89C, LB L89S, LG L890 LS L89K, LO L89K, LY L89K LS L896, LA L896, LO L896, LY L896 - TOPLED LS T670, LO T670, LY T670, LG T670, LP T670 LSG T670, LSP T670, LSY T670, LOP T670, LYG T670 LG T671, LOG T671, LSG T671 LB T673, LV T673, LT T673, LW T673 LH T674 LS T676, LA T676, LO T676, LY T676, LB T676, LH T676, LSB T676, LW T676 LB T67C, LV T67C, LT T67C, LS T67K, LO T67K, LY T67K, LW E67C LS E67B, LA E67B, LO E67B, LY E67B, LB E67C, LV E67C, LT E67C LW T67C LS T679, LY T679, LG T679 LS T770, LO T770, LY T770, LG T770, LP T770 LB T773, LV T773, LT T773, LW T773 LH T774 LS E675, LA E675, LY E675, LS T675 LS T776, LA T776, LO T776, LY T776, LB T776 LHGB T686 LT T68C, LB T68C - Hyper Mini TOPLED® LB M676 - Mini TOPLED Santana® LG M470 LS M47K, LO M47K, LY M47K Source: http://www.osram.convergy.de LUXEON: - LUMILED® LXK2-PW12-R00, LXK2-PW12-S00, LXK2-PW14-U00, LXK2-PW14-V00 LXK2-PM12-R00, LXK2-PM12-S00, LXK2-PM14-U00 LXK2-PE12-Q00, LXK2-PE12-R00, LXK2-PE12-S00, LXK2-PE14-T00, LXK2-PE14-U00 LXK2-PB12-K00, LXK2-PB12-L00, LXK2-PB12-M00, LXK2-PB14-N00, LXK2-PB14-P00, LXK2-PB14-Q00 LXK2-PR12-L00, LXK2-PR12-M00, LXK2-PR14-Q00, LXK2-PR14-R00 LXK2-PD12-Q00, LXK2-PD12-R00, LXK2-PD12-S00 LXK2-PH12-R00, LXK2-PH12-S00 LXK2-PL12-P00, LXK2-PL12-Q00, LXK2-PL12-R00 Source: www.luxeon.com KINGBRIGHT: KA-3528ASYC Source: www.kingbright.com
MOTOR_OUT = con-harting-ml:ML10: HARTING; OC_FARNELL: unknown; OC_NEWARK: unknown
R1-R71 R80-R91 = rcl:R-EU_: RESISTOR, European symbol; SPICEPREFIX: R
R72-R76 R79 = SparkFun-Resistors:4.7KOHM: 4.7kΩ resistor A resistor is a passive two-terminal electrical component that implements electrical resistance as a circuit element. Resistors act to reduce current flow, and, at the same time, act to lower voltage levels within circuits. - Wikipedia; PROD_ID: RES-07857; VALUE: 4.7k
R77 R78 = SparkFun-Resistors:9.76KOHM: 9.76kΩ resistor A resistor is a passive two-terminal electrical component that implements electrical resistance as a circuit element. Resistors act to reduce current flow, and, at the same time, act to lower voltage levels within circuits. - Wikipedia; PROD_ID: RES-12534
SERIALCON1 SERIALCON2 SV2 SV4 SV6 = con-harting-ml:ML6: HARTING; OC_FARNELL: unknown; OC_NEWARK: unknown
SS SS1-SS4 = pinhead:PINHD-1X3: PIN HEADER
U1 U4 U5 U7 U8 U20 U21 = INA333AIDGKR:INA333AIDGKR: 0.05ìV/°C max, SINGLE-SUPPLY CMOS OPERATIONAL AMPLIFIERS Zer.-Drift Series; MPN: INA333AIDGKR; OC_FARNELL: 2295977; OC_NEWARK: 01P0907; PACKAGE: MSOP-8; SUPPLIER: Texas Instruments
U2 U3 U6 U19 = Texas Instruments - OPA2314AID:TEXAS_INSTRUMENTS_OPA2314AID: TI-OPA-8_2; CIIVA_IDS: 3236142; CMRR_MIND_B: 75; CODE__JEDEC: MS-012; COMPONENT_LINK_1_DESCRIPTION: Manufacturer URL; COMPONENT_LINK_1_URL: http://www.ti.com/; COMPONENT_LINK_3_DESCRIPTION: Package Specification; COMPONENT_LINK_3_URL: http://www.ti.com/litv/pdf/msoi002j; DATASHEET: http://www.ti.com/lit/ds/symlink/opa2314.pdf; DATASHEET_VERSION: SBOS563E; ECO__PLAN: Green (RoHS & no Sb/Br); FOOTPRINT_VARIANT_NAME_0: Level C; FOOTPRINT_VARIANT_NAME_1: Level B; FOOTPRINT_VARIANT_NAME_2: Level A; GBW_TYP_MHZ: 3; IIB_MAXP_A: 10; IMPORTED: yes; IMPORTED_FROM: vault; IMPORT_TS: 1521849348; IQ_PER_CHANNELMAXMA: 0.19; MF: Texas Instruments; MOUNTING_TECHNOLOGY: Surface Mount; MPN: OPA2314AID; NUMBER_OF_CHANNELS: 2; OFFSET_DRIFTTYPUVC: 1; PACKAGE: D0008A; PACKAGE_DESCRIPTION: 8-Pin Plastic Small Outline, Body 4.9 x 3.9 mm, Pitch 1.27 mm; PACKAGE_VERSION: 4040047-3/M, 06/2011; PACKING: TUBE; PREFIX: U; RATING: Catalog; RELEASE_DATE: 1464326787; SLEW_RATETYPVUS: 1.5; TOTAL_SUPPLY_VOLTAGEMAX5V_IS_5__5V_IS_10: 5.5; TOTAL_SUPPLY_VOLTAGEMIN5V_IS_5__5V_IS_10: 1.8; VAULT_GUID: FC3CCBEA-EF8A-4D47-8376-D421FB011C9F; VAULT_REVISION: 64FE72A6-CE39-49AD-A8CF-FF128F609D7E; VIO_25CMAXMV: 2.5
U9-U18 = Texas Instruments - OPA2314AID_neu:TEXAS_INSTRUMENTS_OPA2314AID: TI-OPA-8_2; CIIVA_IDS: 3236142; CMRR_MIND_B: 75; CODE__JEDEC: MS-012; COMPONENT_LINK_1_DESCRIPTION: Manufacturer URL; COMPONENT_LINK_1_URL: http://www.ti.com/; COMPONENT_LINK_3_DESCRIPTION: Package Specification; COMPONENT_LINK_3_URL: http://www.ti.com/litv/pdf/msoi002j; DATASHEET: http://www.ti.com/lit/ds/symlink/opa2314.pdf; DATASHEET_VERSION: SBOS563E; ECO__PLAN: Green (RoHS & no Sb/Br); FOOTPRINT_VARIANT_NAME_0: Level C; FOOTPRINT_VARIANT_NAME_1: Level B; FOOTPRINT_VARIANT_NAME_2: Level A; GBW_TYP_MHZ: 3; IIB_MAXP_A: 10; IMPORTED: yes; IMPORTED_FROM: vault; IMPORT_TS: 1521849348; IQ_PER_CHANNELMAXMA: 0.19; MF: Texas Instruments; MOUNTING_TECHNOLOGY: Surface Mount; MPN: OPA2314AID; NUMBER_OF_CHANNELS: 2; OFFSET_DRIFTTYPUVC: 1; PACKAGE: D0008A; PACKAGE_DESCRIPTION: 8-Pin Plastic Small Outline, Body 4.9 x 3.9 mm, Pitch 1.27 mm; PACKAGE_VERSION: 4040047-3/M, 06/2011; PACKING: TUBE; PREFIX: U; RATING: Catalog; RELEASE_DATE: 1464326787; SLEW_RATETYPVUS: 1.5; TOTAL_SUPPLY_VOLTAGEMAX5V_IS_5__5V_IS_10: 5.5; TOTAL_SUPPLY_VOLTAGEMIN5V_IS_5__5V_IS_10: 1.8; VAULT_GUID: FC3CCBEA-EF8A-4D47-8376-D421FB011C9F; VAULT_REVISION: 64FE72A6-CE39-49AD-A8CF-FF128F609D7E; VIO_25CMAXMV: 2.5
U$1 U$3 U$4 U$8 = USR_SJ2-4514a:SJ2-3514A
U$2 = LT1678:LT1678: LT1678 dual OPV RRIO S8 8-Lead SO Package Single Supply Farnell OC: 1330689
U$5 = Piezo-Grundschaltung5V_2:MAX6018X_MAX6018X
U$6 U$7 = micro-stm_v3:STM32L476R*T: ARM 32-bit Cortex™-M4 CPU 80 MHz maximum frequency 256..1024 Kbytes of Flash memory 128 kbytes of SRAM 51 GPIOs 1.71 to 3.6 V application supply